# EAGLE schematic current stabiliser (EAGLE 8.3.2)

## Sheet 1 of 12
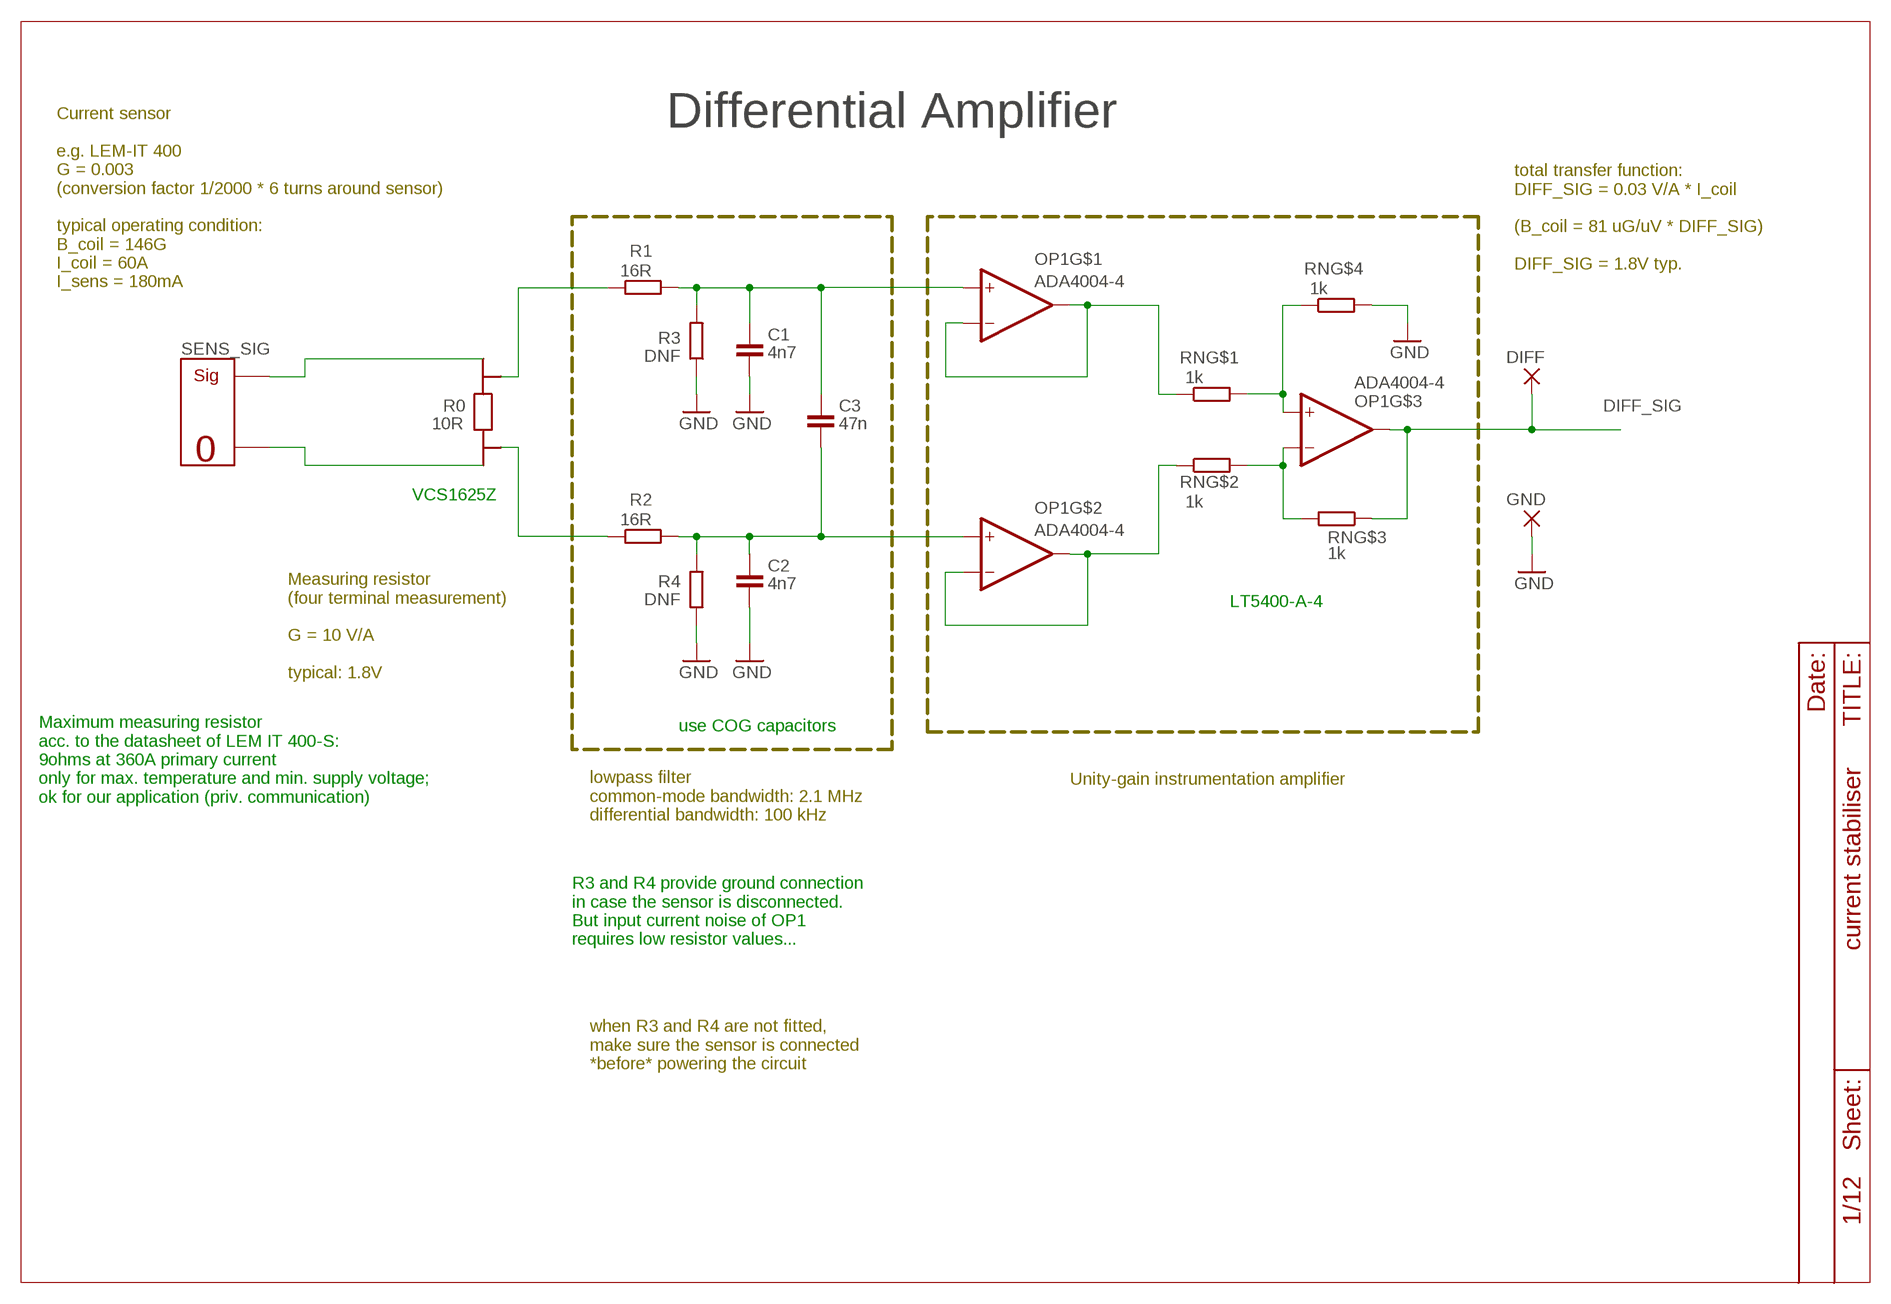
[diagram p0: schematic, sheet 1]

### Parts
C1  4n7  CAP0603  [0603]
C2  4n7  CAP0603  [0603]
C3  47n  CAP0603  [0603]
DIFF  TESTPOINT  [TESTPOINT]
GND  TESTPOINT  [TESTPOINT]
OP1  ADA4004-4  OPAMP_QUADSO14  [SO14]
R0  10R  VCS1625Z  [VCS1625Z]
R1  16R  RES0603  [0603]
R2  16R  RES0603  [0603]
R3  DNF  RES0603  [0603]
R4  DNF  RES0603  [0603]
RN  1k  LT5400-EP  [MSOP8-EP]
SENS_SIG  MOLEX_SIG_2PIN  [MOLEX-2PIN]

### Nets
DIFF_SIG: DIFF.P$1(P) OP1.P$8(OUT) RN.3 ; also sheet 2
GND: C1.2 C2.2 GND.P$1(P) R3.1 R4.1 RN.5 ; also sheet 2,3,4,5,6,7,8,9,10,11,12
N$1: R0.P$1(I1) SENS_SIG.2(SIG)
N$3: C2.1 C3.2 OP1.P$5(+IN) R2.2 R4.2
N$4: R0.P$4(E2) R2.1
N$5: R0.P$3(E1) R1.1
N$6: C1.1 C3.1 OP1.P$3(+IN) R1.2 R3.2
N$7: OP1.P$1(OUT) OP1.P$2(-IN) RN.1
N$8: OP1.P$6(-IN) OP1.P$7(OUT) RN.2
N$9: OP1.P$10(+IN) RN.4 RN.8
N$11: OP1.P$9(-IN) RN.6 RN.7
SENS_RETURN: R0.P$2(I2) SENS_SIG.1(GND)
Unconnected: OP1.P$12(+IN) OP1.P$13(-IN) OP1.P$14(OUT)

### Notes on the sheet
- Differential Amplifier
- total transfer function:
  DIFF_SIG = 0.03 V/A * I_coil
  
  (B_coil = 81 uG/uV * DIFF_SIG)
  
  DIFF_SIG = 1.8V typ.
- Current sensor
  
  e.g. LEM-IT 400
  G = 0.003
  (conversion factor 1/2000 * 6 turns around sensor)
  
  typical operating condition: 
  B_coil = 146G
  I_coil = 60A
  I_sens = 180mA
- VCS1625Z
- LT5400-A-4
- Measuring resistor
  (four terminal measurement)
  
  G = 10 V/A
  
  typical: 1.8V
- use COG capacitors
- Unity-gain instrumentation amplifier
- Maximum measuring resistor 
  acc. to the datasheet of LEM IT 400-S: 
  9ohms at 360A primary current
  only for max. temperature and min. supply voltage; 
  ok for our application (priv. communication)
- lowpass filter
  common-mode bandwidth: 2.1 MHz
  differential bandwidth: 100 kHz
- R3 and R4 provide ground connection
  in case the sensor is disconnected. 
  But input current noise of OP1 
  requires low resistor values...
- when R3 and R4 are not fitted,
  make sure the sensor is connected
  *before* powering the circuit

## Sheet 2 of 12
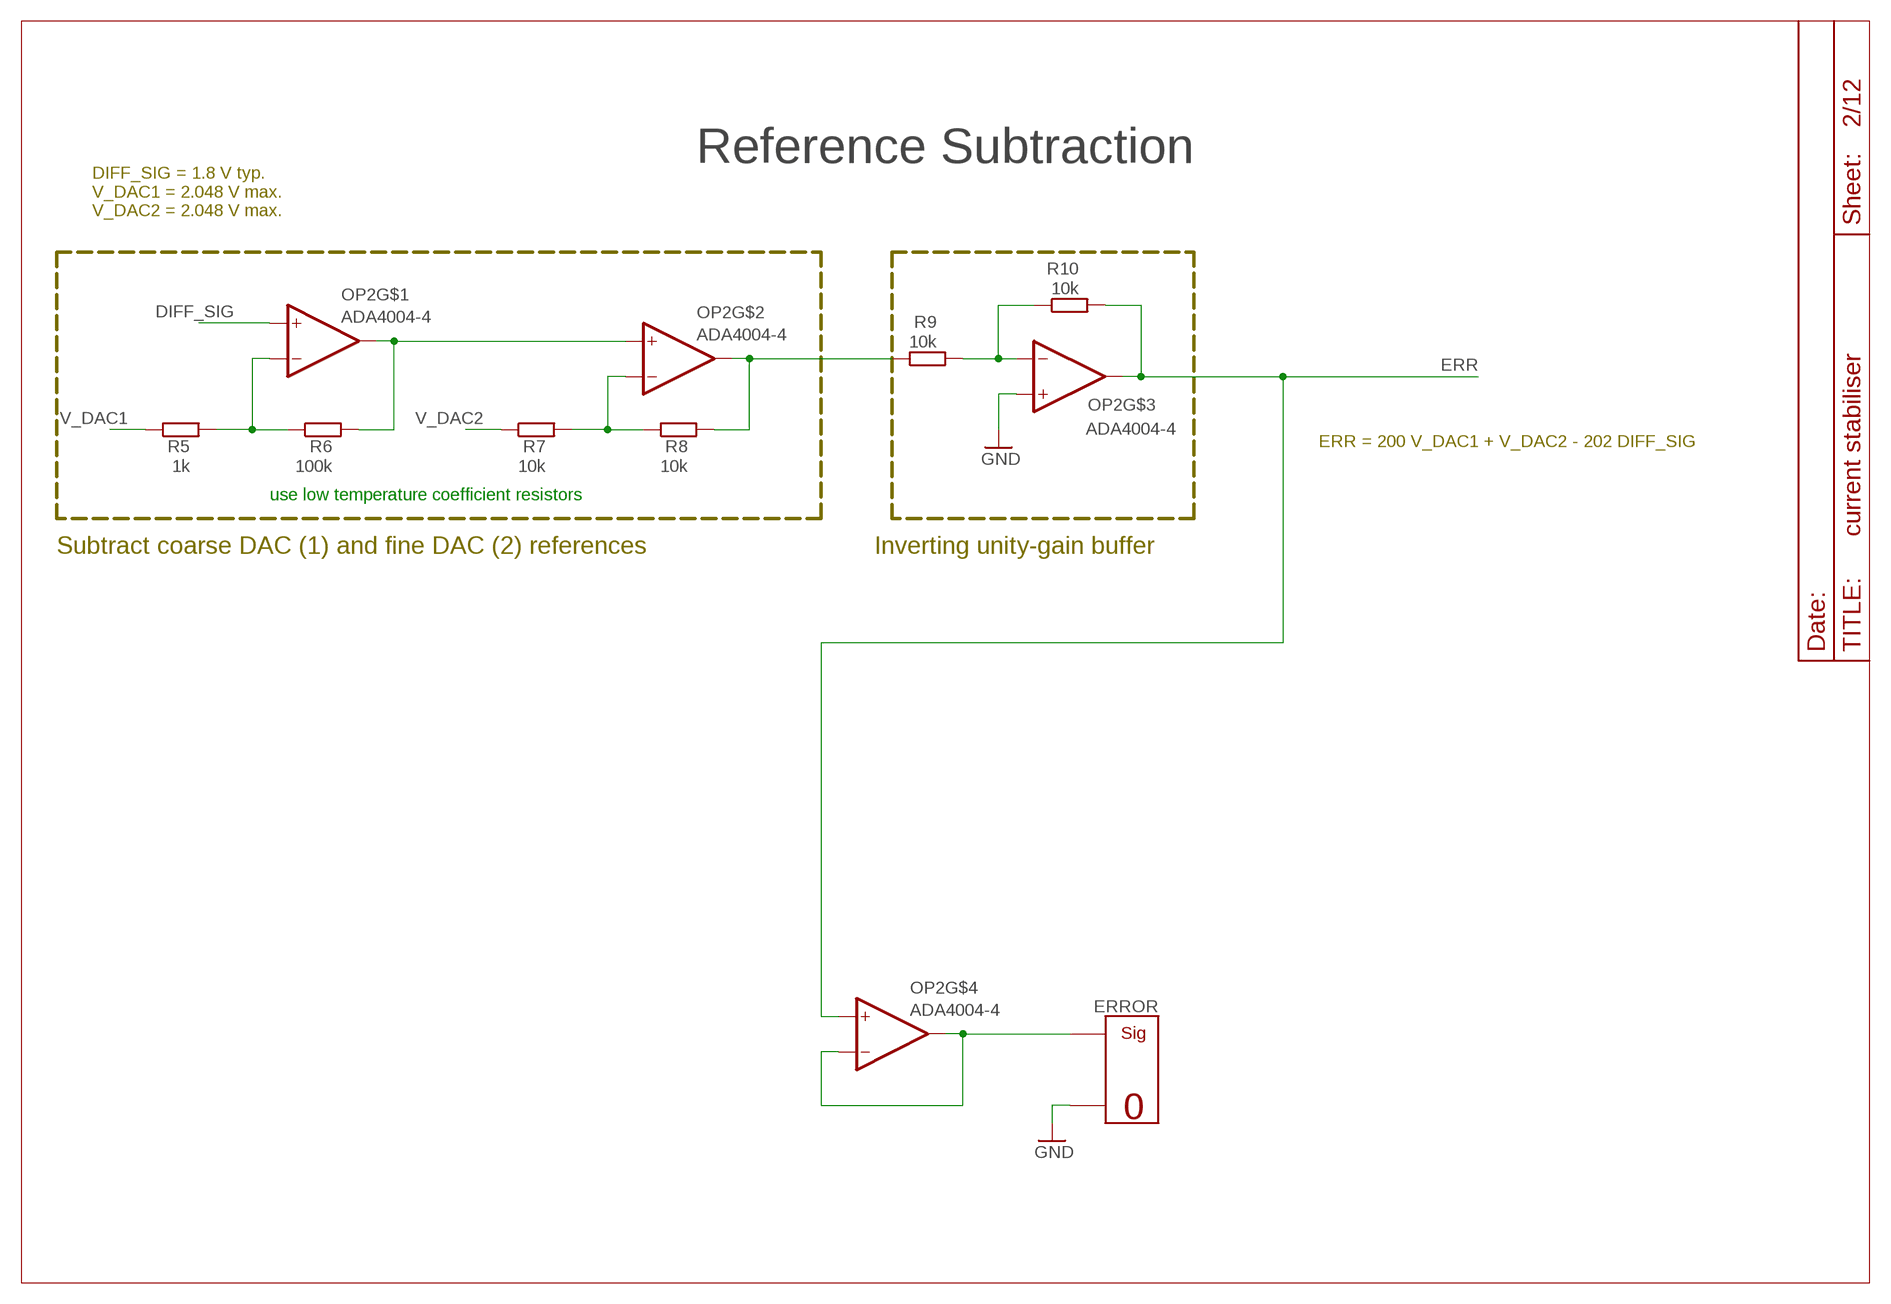
[diagram p1: schematic, sheet 2]

### Parts
ERROR  MOLEX_SIG_2PIN  [MOLEX-2PIN]
OP2  ADA4004-4  OPAMP_QUADSO14  [SO14]
R5  1k  RES0603  [0603]
R6  100k  RES0603  [0603]
R7  10k  RES0603  [0603]
R8  10k  RES0603  [0603]
R9  10k  RES0603  [0603]
R10  10k  RES0603  [0603]

### Nets
DIFF_SIG: OP2.P$3(+IN) ; also sheet 1
ERR: OP2.P$8(OUT) OP2.P$12(+IN) R10.2 ; also sheet 3
GND: ERROR.1(GND) OP2.P$10(+IN) ; also sheet 1,3,4,5,6,7,8,9,10,11,12
N$10: OP2.P$2(-IN) R5.2 R6.1
N$12: OP2.P$9(-IN) R9.2 R10.1
N$13: OP2.P$1(OUT) OP2.P$5(+IN) R6.2
N$14: OP2.P$6(-IN) R7.2 R8.1
N$15: OP2.P$7(OUT) R8.2 R9.1
N$18: ERROR.2(SIG) OP2.P$13(-IN) OP2.P$14(OUT)
V_DAC1: R5.1 ; also sheet 7
V_DAC2: R7.1 ; also sheet 7

### Notes on the sheet
- Reference Subtraction
- DIFF_SIG = 1.8 V typ.
  V_DAC1 = 2.048 V max.
  V_DAC2 = 2.048 V max.
- ERR = 200 V_DAC1 + V_DAC2 - 202 DIFF_SIG
- use low temperature coefficient resistors
- Subtract coarse DAC (1) and fine DAC (2) references | Inverting unity-gain buffer

## Sheet 3 of 12
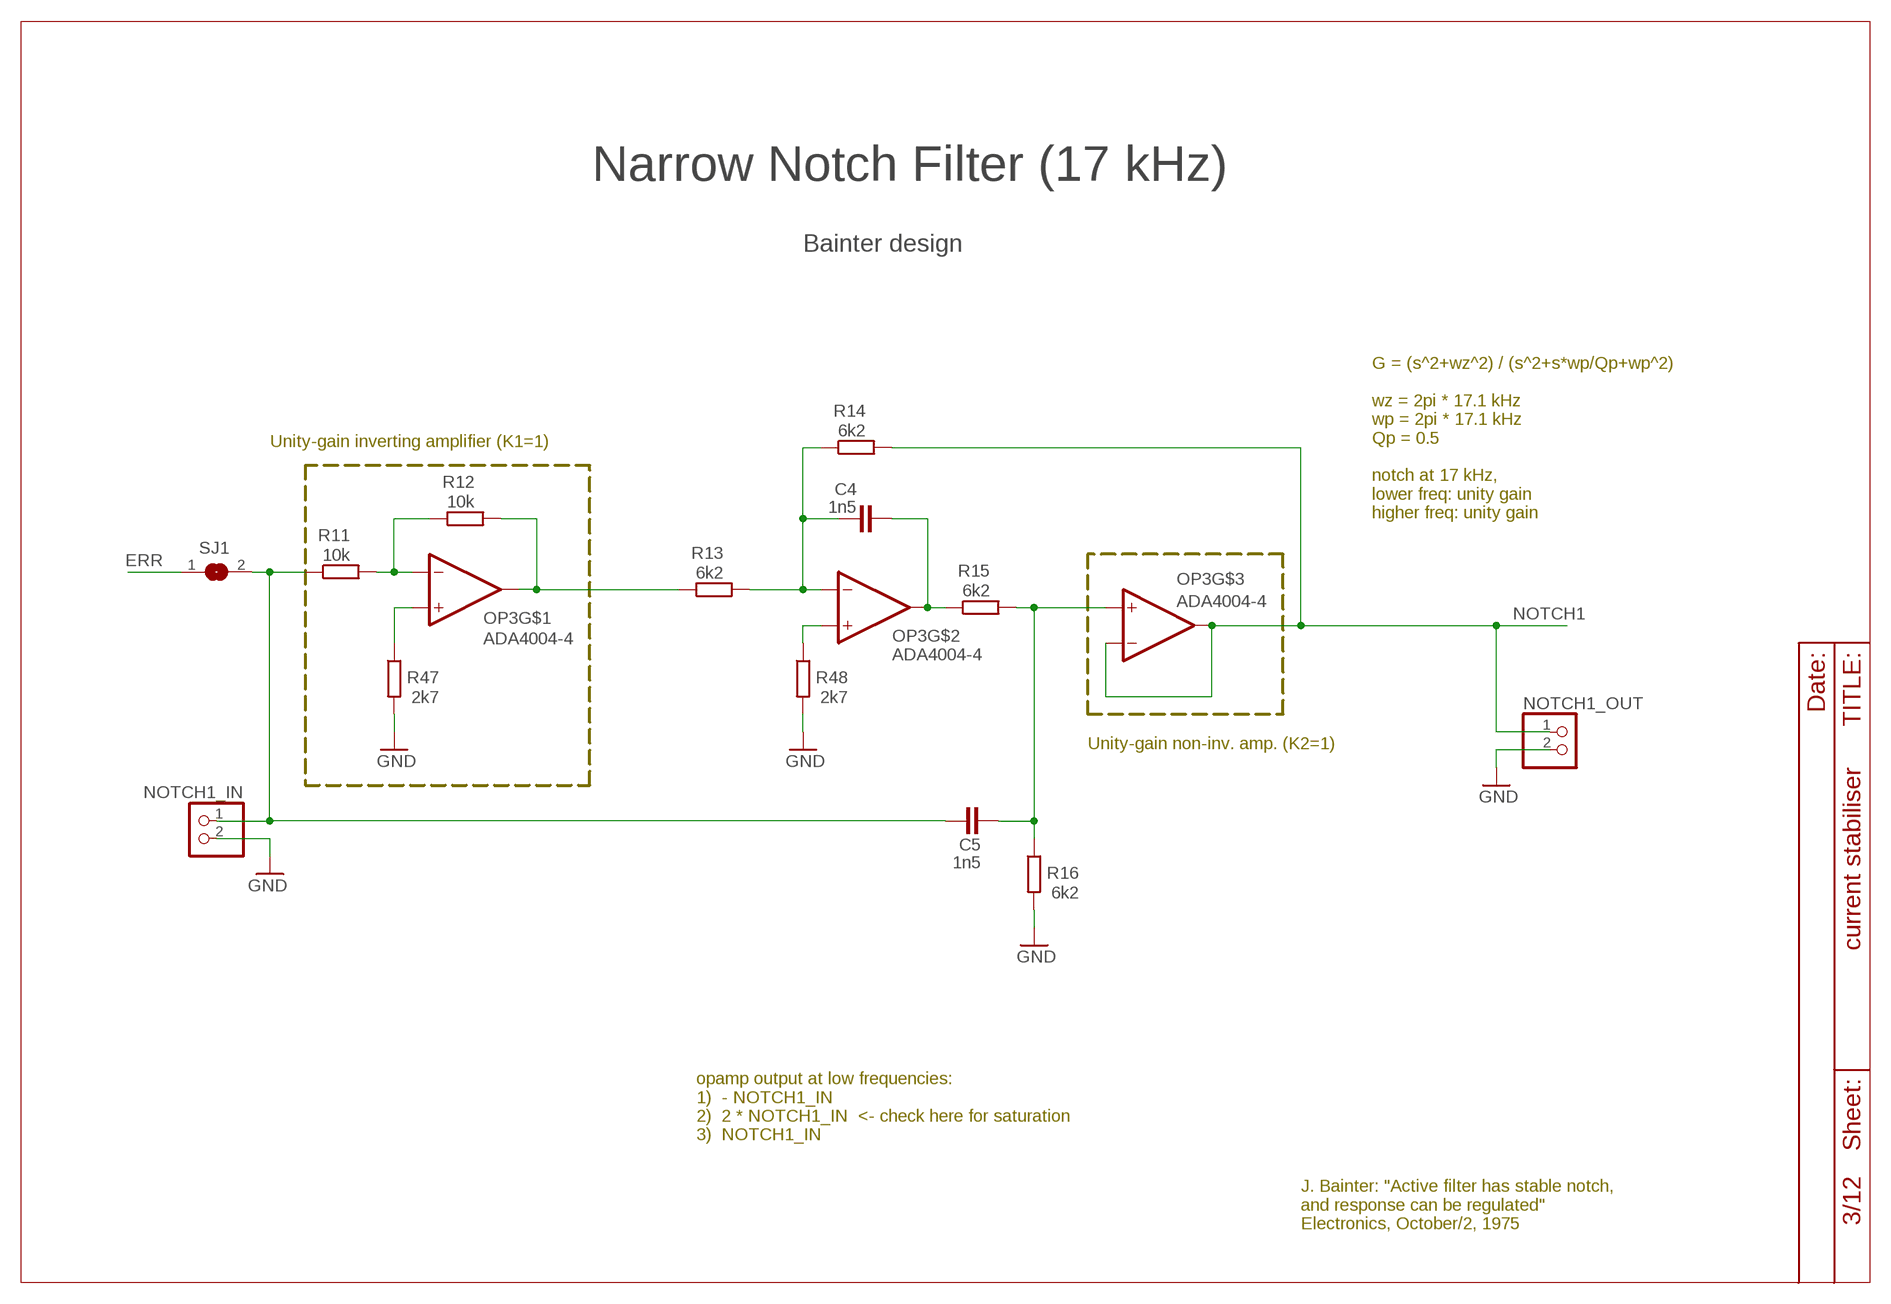
[diagram p2: schematic, sheet 3]

### Parts
C4  1n5  CAP0603  [0603]
C5  1n5  CAP0603  [0603]
NOTCH1_IN  PINHD-1X2  [1X02]
NOTCH1_OUT  PINHD-1X2  [1X02]
OP3  ADA4004-4  OPAMP_QUADSO14  [SO14]
R11  10k  RES0603  [0603]
R12  10k  RES0603  [0603]
R13  6k2  RES0603  [0603]
R14  6k2  RES0603  [0603]
R15  6k2  RES0603  [0603]
R16  6k2  RES0603  [0603]
R47  2k7  RES0603  [0603]
R48  2k7  RES0603  [0603]
SJ1  SJ  [SJ]

### Nets
ERR: SJ1.1 ; also sheet 2
GND: NOTCH1_IN.2 NOTCH1_OUT.2 R16.2 R47.2 R48.2 ; also sheet 1,2,4,5,6,7,8,9,10,11,12
N$16: OP3.P$2(-IN) R11.2 R12.1
N$17: OP3.P$1(OUT) R12.2 R13.1
N$19: C4.1 OP3.P$6(-IN) R13.2 R14.1
N$20: C4.2 OP3.P$7(OUT) R15.1
N$22: C5.2 OP3.P$10(+IN) R15.2 R16.1
N$72: C5.1 NOTCH1_IN.1 R11.1 SJ1.2
N$79: OP3.P$3(+IN) R47.1
N$80: OP3.P$5(+IN) R48.1
NOTCH1: NOTCH1_OUT.1 OP3.P$8(OUT) OP3.P$9(-IN) R14.2 ; also sheet 4
Unconnected: OP3.P$12(+IN) OP3.P$13(-IN) OP3.P$14(OUT)

### Notes on the sheet
- Narrow Notch Filter (17 kHz)
- Bainter design
- Unity-gain inverting amplifier (K1=1)
- G = (s^2+wz^2) / (s^2+s*wp/Qp+wp^2)
  
  wz = 2pi * 17.1 kHz
  wp = 2pi * 17.1 kHz
  Qp = 0.5
  
  notch at 17 kHz,
  lower freq: unity gain
  higher freq: unity gain
- Unity-gain non-inv. amp. (K2=1)
- opamp output at low frequencies:
  1)  - NOTCH1_IN
  2)  2 * NOTCH1_IN  <- check here for saturation
  3)  NOTCH1_IN
- J. Bainter: "Active filter has stable notch, 
  and response can be regulated"
  Electronics, October/2, 1975

## Sheet 4 of 12
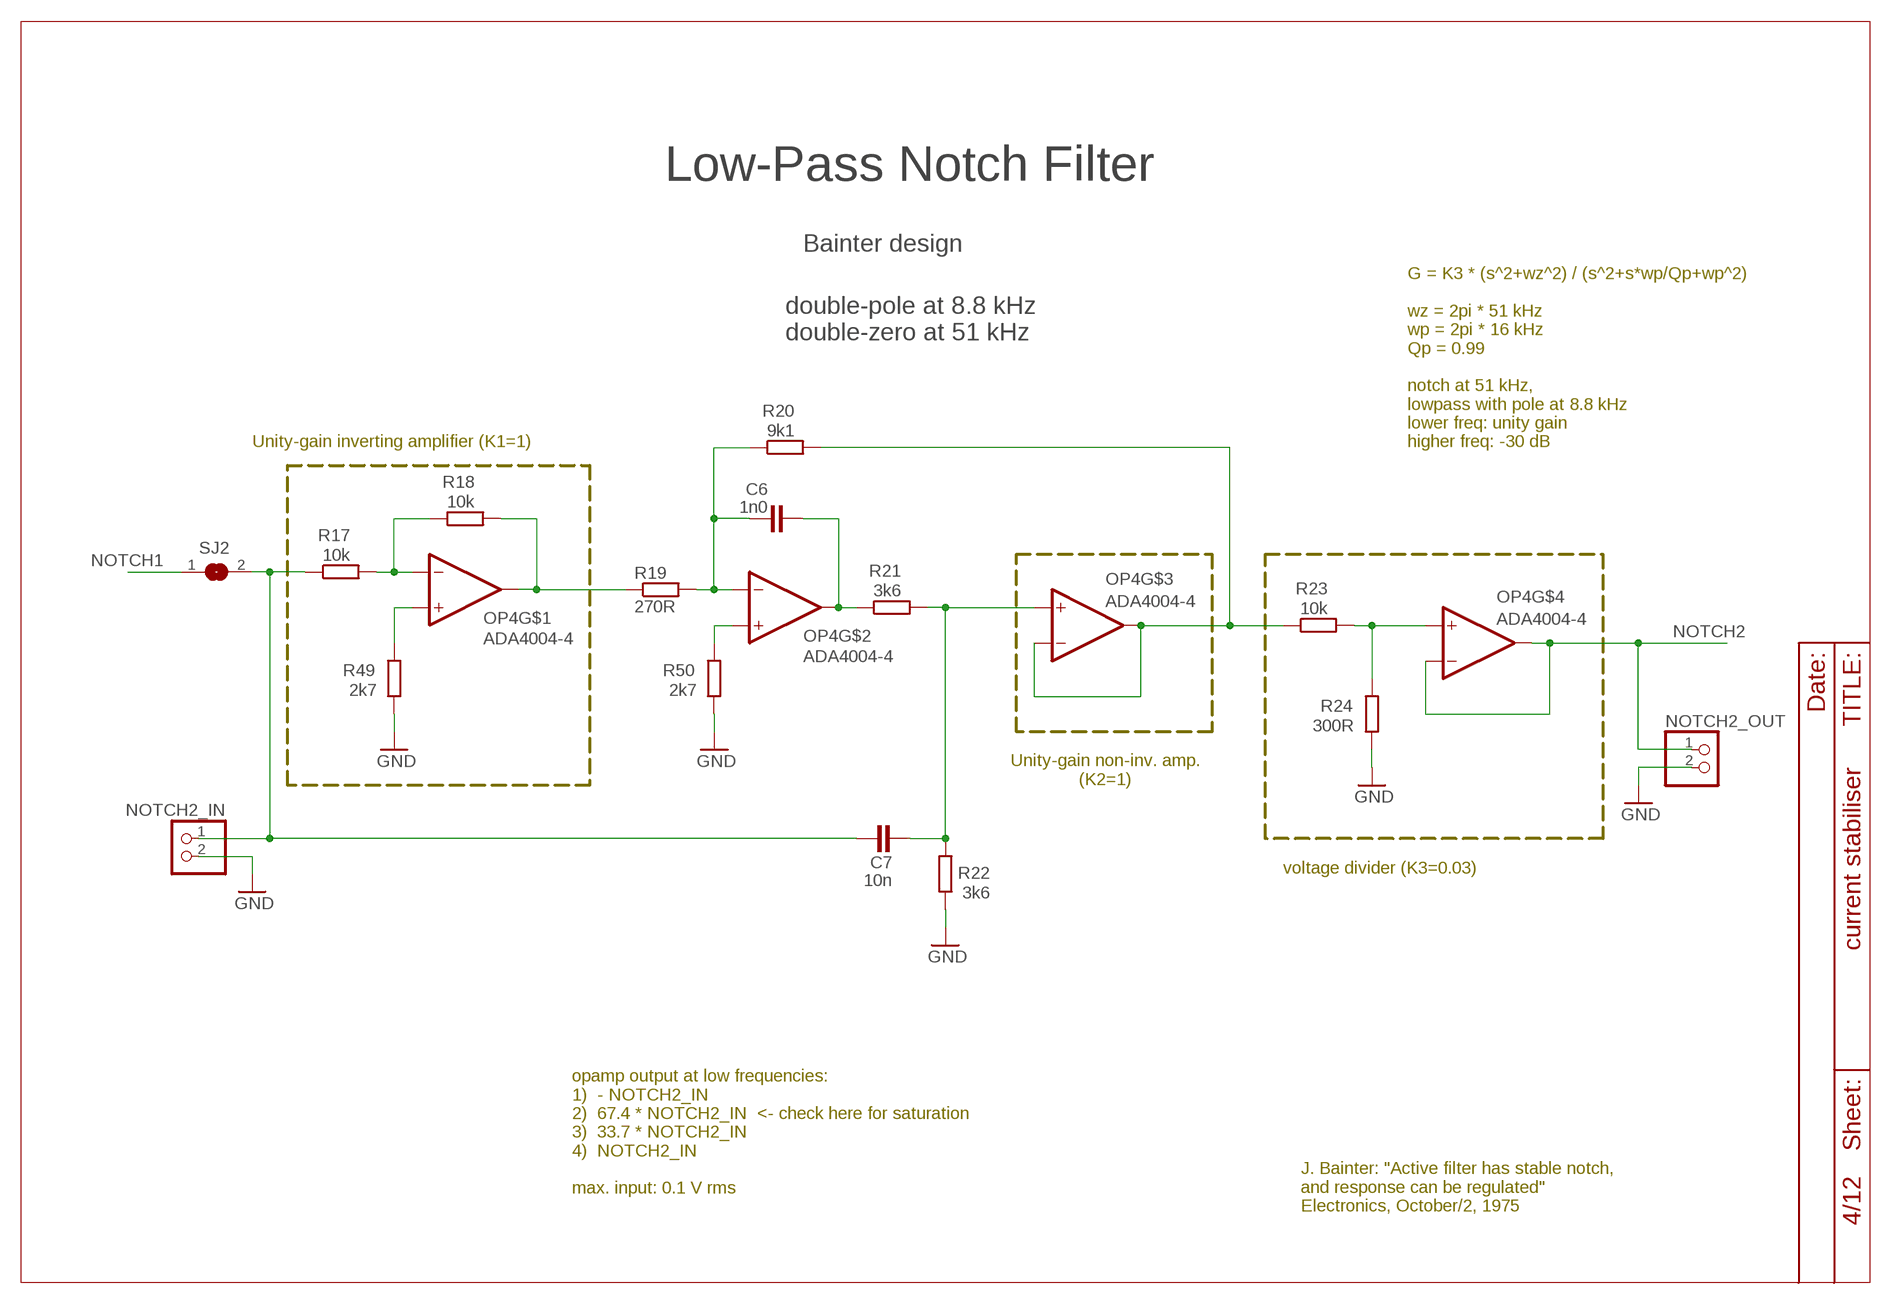
[diagram p3: schematic, sheet 4]

### Parts
C6  1n0  CAP0603  [0603]
C7  10n  CAP0603  [0603]
NOTCH2_IN  PINHD-1X2  [1X02]
NOTCH2_OUT  PINHD-1X2  [1X02]
OP4  ADA4004-4  OPAMP_QUADSO14  [SO14]
R17  10k  RES0603  [0603]
R18  10k  RES0603  [0603]
R19  270R  RES0603  [0603]
R20  9k1  RES0603  [0603]
R21  3k6  RES0603  [0603]
R22  3k6  RES0603  [0603]
R23  10k  RES0603  [0603]
R24  300R  RES0603  [0603]
R49  2k7  RES0603  [0603]
R50  2k7  RES0603  [0603]
SJ2  SJ  [SJ]

### Nets
GND: NOTCH2_IN.2 NOTCH2_OUT.2 R22.1 R24.1 R49.1 R50.1 ; also sheet 1,2,3,5,6,7,8,9,10,11,12
N$21: OP4.P$2(-IN) R17.2 R18.1
N$23: OP4.P$1(OUT) R18.2 R19.1
N$24: C6.1 OP4.P$6(-IN) R19.2 R20.1
N$25: C7.2 OP4.P$10(+IN) R21.2 R22.2
N$26: C6.2 OP4.P$7(OUT) R21.1
N$27: OP4.P$8(OUT) OP4.P$9(-IN) R20.2 R23.1
N$28: OP4.P$12(+IN) R23.2 R24.2
N$74: C7.1 NOTCH2_IN.1 R17.1 SJ2.2
N$76: OP4.P$3(+IN) R49.2
N$77: OP4.P$5(+IN) R50.2
NOTCH1: SJ2.1 ; also sheet 3
NOTCH2: NOTCH2_OUT.1 OP4.P$13(-IN) OP4.P$14(OUT) ; also sheet 5

### Notes on the sheet
- Low-Pass Notch Filter
- Bainter design
- double-pole at 8.8 kHz
  double-zero at 51 kHz
- Unity-gain inverting amplifier (K1=1)
- G = K3 * (s^2+wz^2) / (s^2+s*wp/Qp+wp^2)
  
  wz = 2pi * 51 kHz
  wp = 2pi * 16 kHz
  Qp = 0.99
  
  notch at 51 kHz,
  lowpass with pole at 8.8 kHz
  lower freq: unity gain
  higher freq: -30 dB
- Unity-gain non-inv. amp.
  (K2=1)
- voltage divider (K3=0.03)
- opamp output at low frequencies:
  1)  - NOTCH2_IN
  2)  67.4 * NOTCH2_IN  <- check here for saturation
  3)  33.7 * NOTCH2_IN
  4)  NOTCH2_IN
  
  max. input: 0.1 V rms
- J. Bainter: "Active filter has stable notch, 
  and response can be regulated"
  Electronics, October/2, 1975

## Sheet 5 of 12
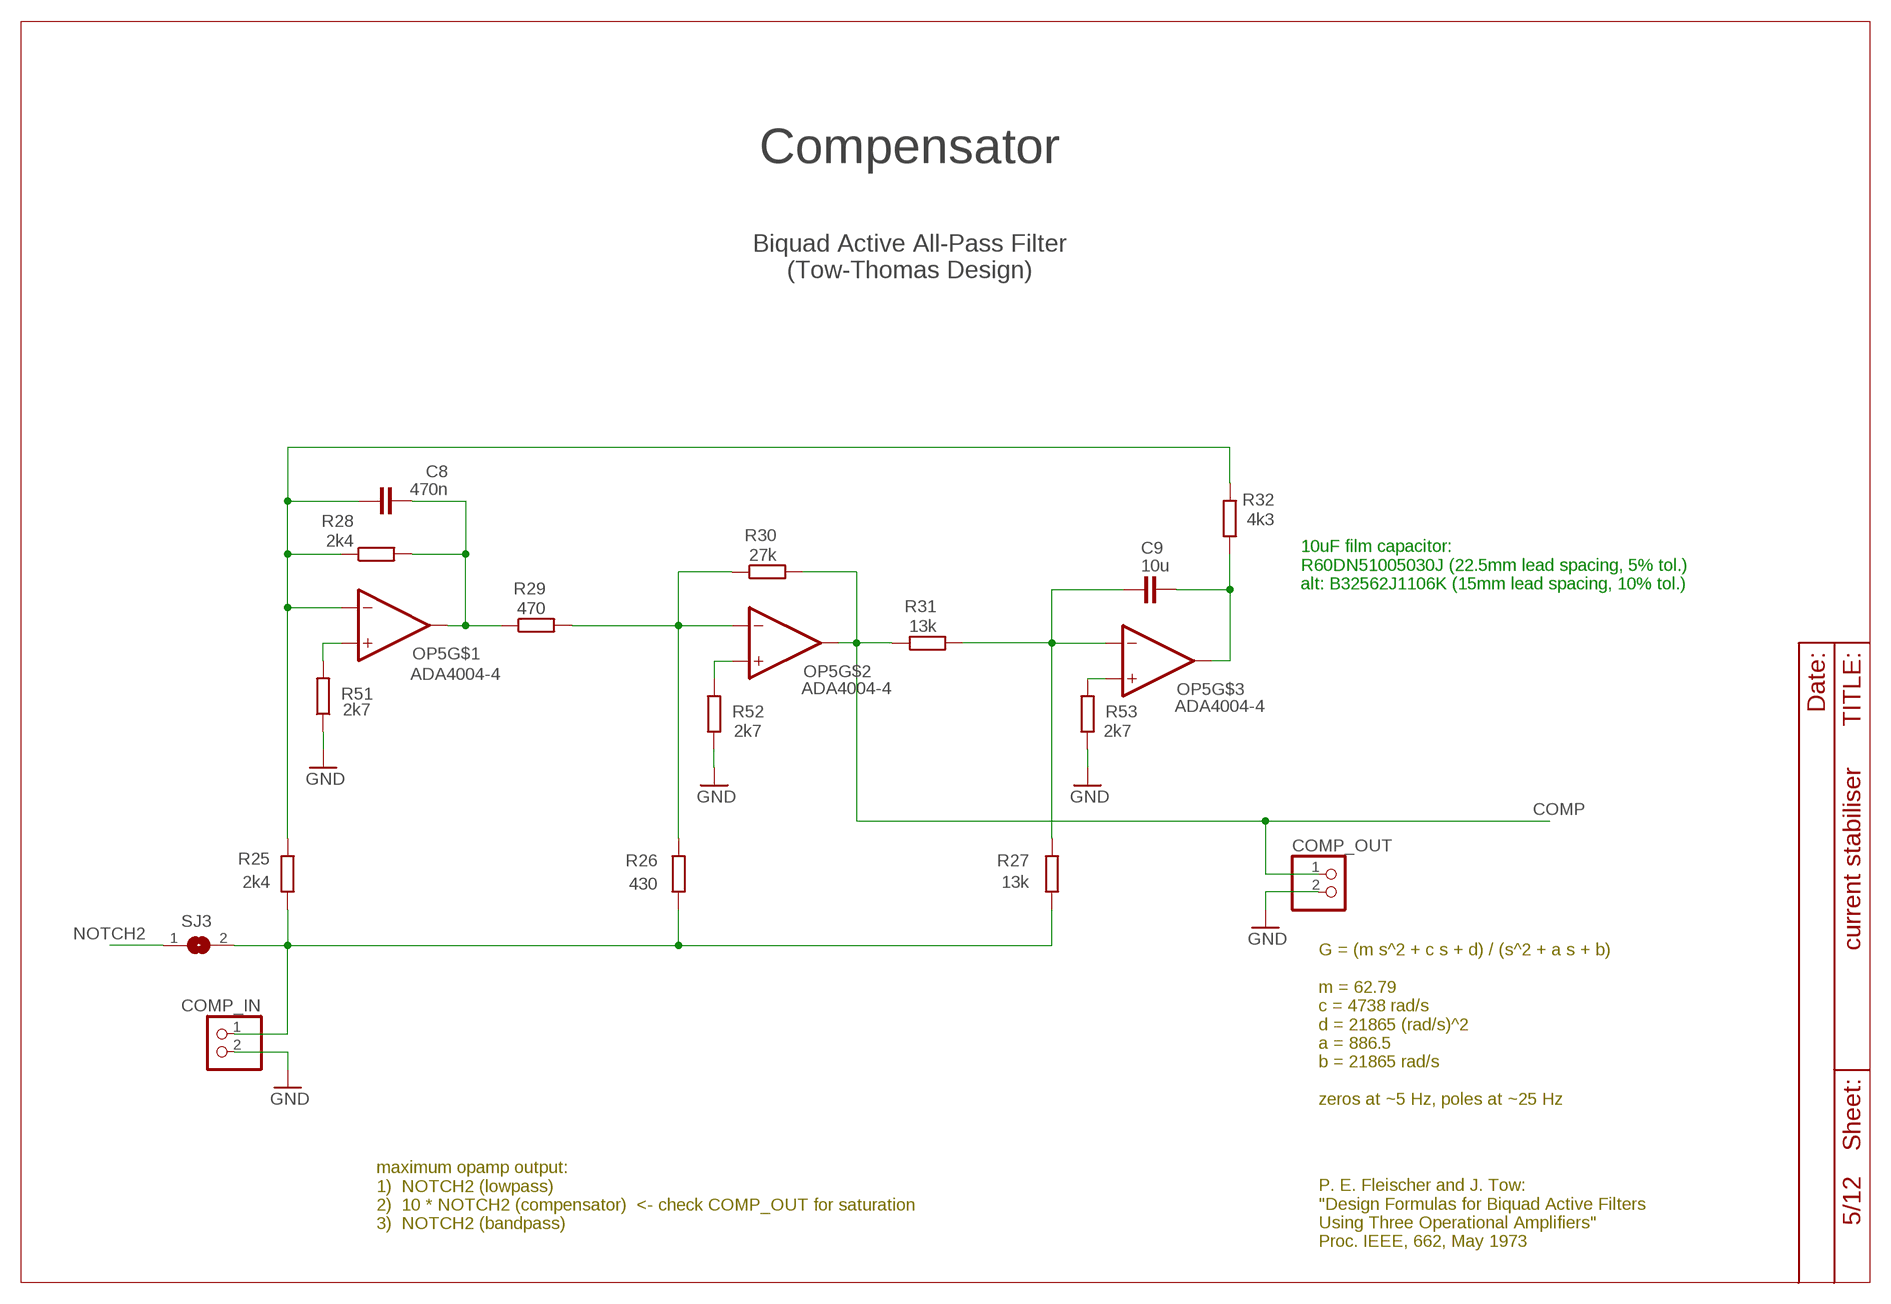
[diagram p4: schematic, sheet 5]

### Parts
C8  470n  CAP0603  [0603]
C9  10u  CAP26.5X8.5  [CAP-26.5X8.5]
COMP_IN  PINHD-1X2  [1X02]
COMP_OUT  PINHD-1X2  [1X02]
OP5  ADA4004-4  OPAMP_QUADSO14  [SO14]
R25  2k4  RES0603  [0603]
R26  430  RES0603  [0603]
R27  13k  RES0603  [0603]
R28  2k4  RES0603  [0603]
R29  470  RES0603  [0603]
R30  27k  RES0603  [0603]
R31  13k  RES0603  [0603]
R32  4k3  RES0603  [0603]
R51  2k7  RES0603  [0603]
R52  2k7  RES0603  [0603]
R53  2k7  RES0603  [0603]
SJ3  SJ  [SJ]

### Nets
COMP: COMP_OUT.1 OP5.P$7(OUT) R30.2 R31.1 ; also sheet 6
GND: COMP_IN.2 COMP_OUT.2 R51.1 R52.1 R53.1 ; also sheet 1,2,3,4,6,7,8,9,10,11,12
N$29: C8.1 OP5.P$2(-IN) R25.2 R28.1 R32.2
N$30: OP5.P$6(-IN) R26.2 R29.2 R30.1
N$31: C9.P$1 OP5.P$9(-IN) R27.2 R31.2
N$32: C8.2 OP5.P$1(OUT) R28.2 R29.1
N$35: C9.P$2 OP5.P$8(OUT) R32.1
N$75: COMP_IN.1 R25.1 R26.1 R27.1 SJ3.2
N$81: OP5.P$3(+IN) R51.2
N$82: OP5.P$5(+IN) R52.2
N$83: OP5.P$10(+IN) R53.2
NOTCH2: SJ3.1 ; also sheet 4
Unconnected: OP5.P$12(+IN) OP5.P$13(-IN) OP5.P$14(OUT)

### Notes on the sheet
- Compensator
- Biquad Active All-Pass Filter
  (Tow-Thomas Design)
- 10uF film capacitor:
  R60DN51005030J (22.5mm lead spacing, 5% tol.)
  alt: B32562J1106K (15mm lead spacing, 10% tol.)
- G = (m s^2 + c s + d) / (s^2 + a s + b)
  
  m = 62.79
  c = 4738 rad/s
  d = 21865 (rad/s)^2
  a = 886.5
  b = 21865 rad/s
  
  zeros at ~5 Hz, poles at ~25 Hz
- maximum opamp output:
  1)  NOTCH2 (lowpass)
  2)  10 * NOTCH2 (compensator)  <- check COMP_OUT for saturation
  3)  NOTCH2 (bandpass)
- P. E. Fleischer and J. Tow: 
  "Design Formulas for Biquad Active Filters 
  Using Three Operational Amplifiers"
  Proc. IEEE, 662, May 1973

## Sheet 6 of 12
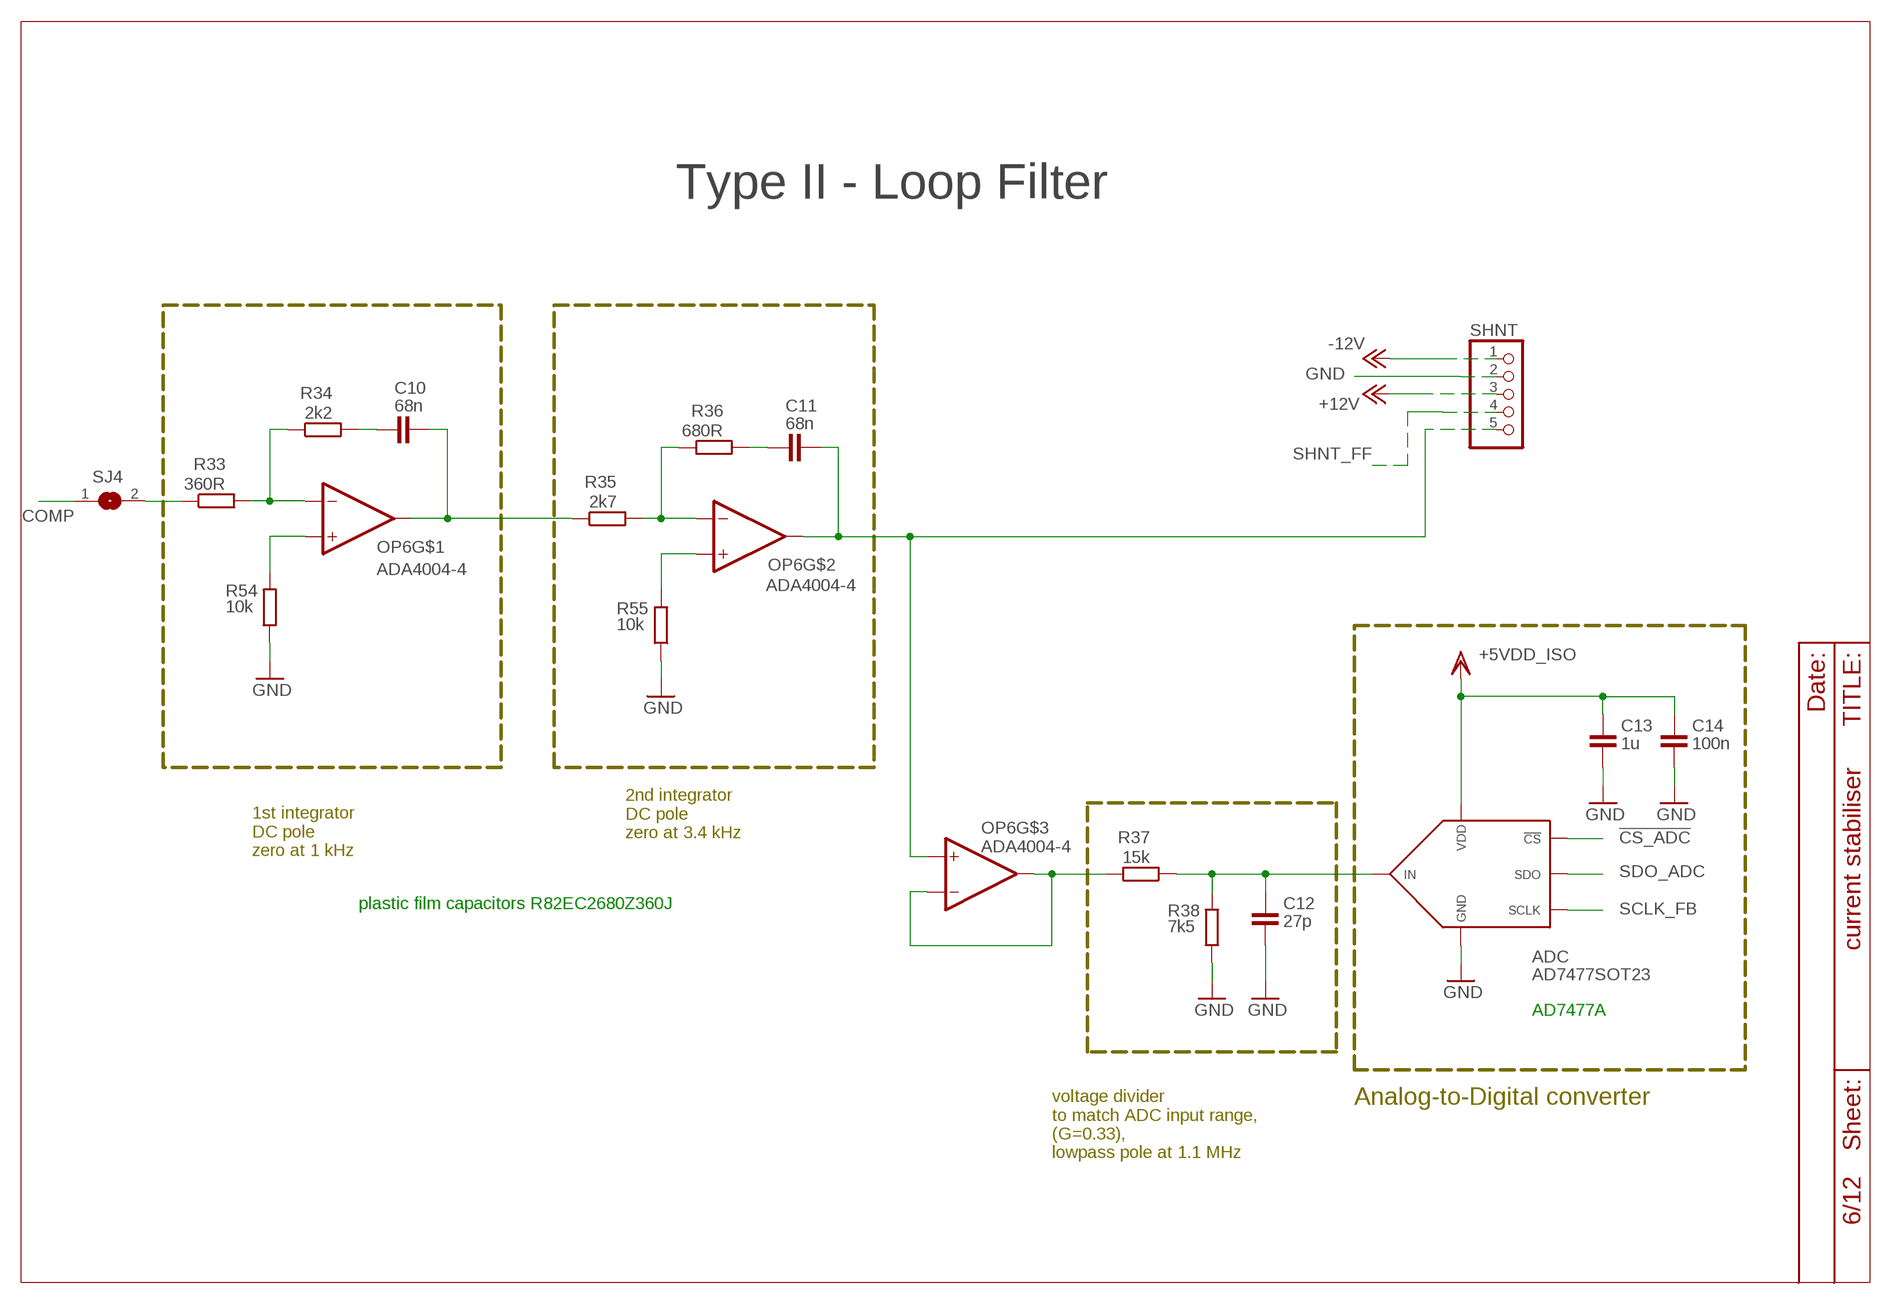
[diagram p5: schematic, sheet 6]

### Parts
ADC  AD7477SOT23  [SOT23-6]
C10  68n  CAPR82EC-7.2X2.5  [CAP-R82EC-7.2X2.5]
C11  68n  CAPR82EC-7.2X2.5  [CAP-R82EC-7.2X2.5]
C12  27p  CAP0603  [0603]
C13  1u  CAP0805  [0805]
C14  100n  CAP0603  [0603]
OP6  ADA4004-4  OPAMP_QUADSO14  [SO14]
R33  360R  RES0603  [0603]
R34  2k2  RES0603  [0603]
R35  2k7  RES0603  [0603]
R36  680R  RES0603  [0603]
R37  15k  RES0603  [0603]
R38  7k5  RES0603  [0603]
R54  10k  RES0603  [0603]
R55  10k  RES0603  [0603]
SHNT  MOLEX-KK-1X5  [MOLEX-KK-5PIN]
SJ4  SJ  [SJ]

### Nets
!CS_ADC: ADC.6(!CS) ; also sheet 10
+5VDD_ISO: ADC.1(VDD) C13.1 C14.1 ; also sheet 8,10,11
+12V: SHNT.3 ; also sheet 11,12
-12V: SHNT.1 ; also sheet 11,12
COMP: SJ4.1 ; also sheet 5
GND: ADC.2(GND) C12.2 C13.2 C14.2 R38.1 R54.1 R55.1 SHNT.2 ; also sheet 1,2,3,4,5,7,8,9,10,11,12
N$33: OP6.P$2(-IN) R33.2 R34.1
N$34: OP6.P$3(+IN) R54.2
N$36: OP6.P$5(+IN) R55.2
N$37: OP6.P$6(-IN) R35.2 R36.1
N$38: C11.P$1 R36.2
N$39: C10.P$1 R34.2
N$40: C10.P$2 OP6.P$1(OUT) R35.1
N$43: OP6.P$8(OUT) OP6.P$9(-IN) R37.2
N$73: ADC.3(IN) C12.1 R37.1 R38.2
N$85: R33.1 SJ4.2
SCLK_FB: ADC.4(SCLK) ; also sheet 7,10
SDO_ADC: ADC.5(SDO) ; also sheet 10
SHNT_FB: C11.P$2 OP6.P$7(OUT) OP6.P$10(+IN) SHNT.5
SHNT_FF: SHNT.4 ; also sheet 8
Unconnected: OP6.P$12(+IN) OP6.P$13(-IN) OP6.P$14(OUT)

### Notes on the sheet
- Type II - Loop Filter
- 2nd integrator
  DC pole
  zero at 3.4 kHz
- 1st integrator
  DC pole
  zero at 1 kHz
- plastic film capacitors R82EC2680Z360J
- AD7477A
- Analog-to-Digital converter
- voltage divider 
  to match ADC input range,
  (G=0.33),
  lowpass pole at 1.1 MHz

## Sheet 7 of 12
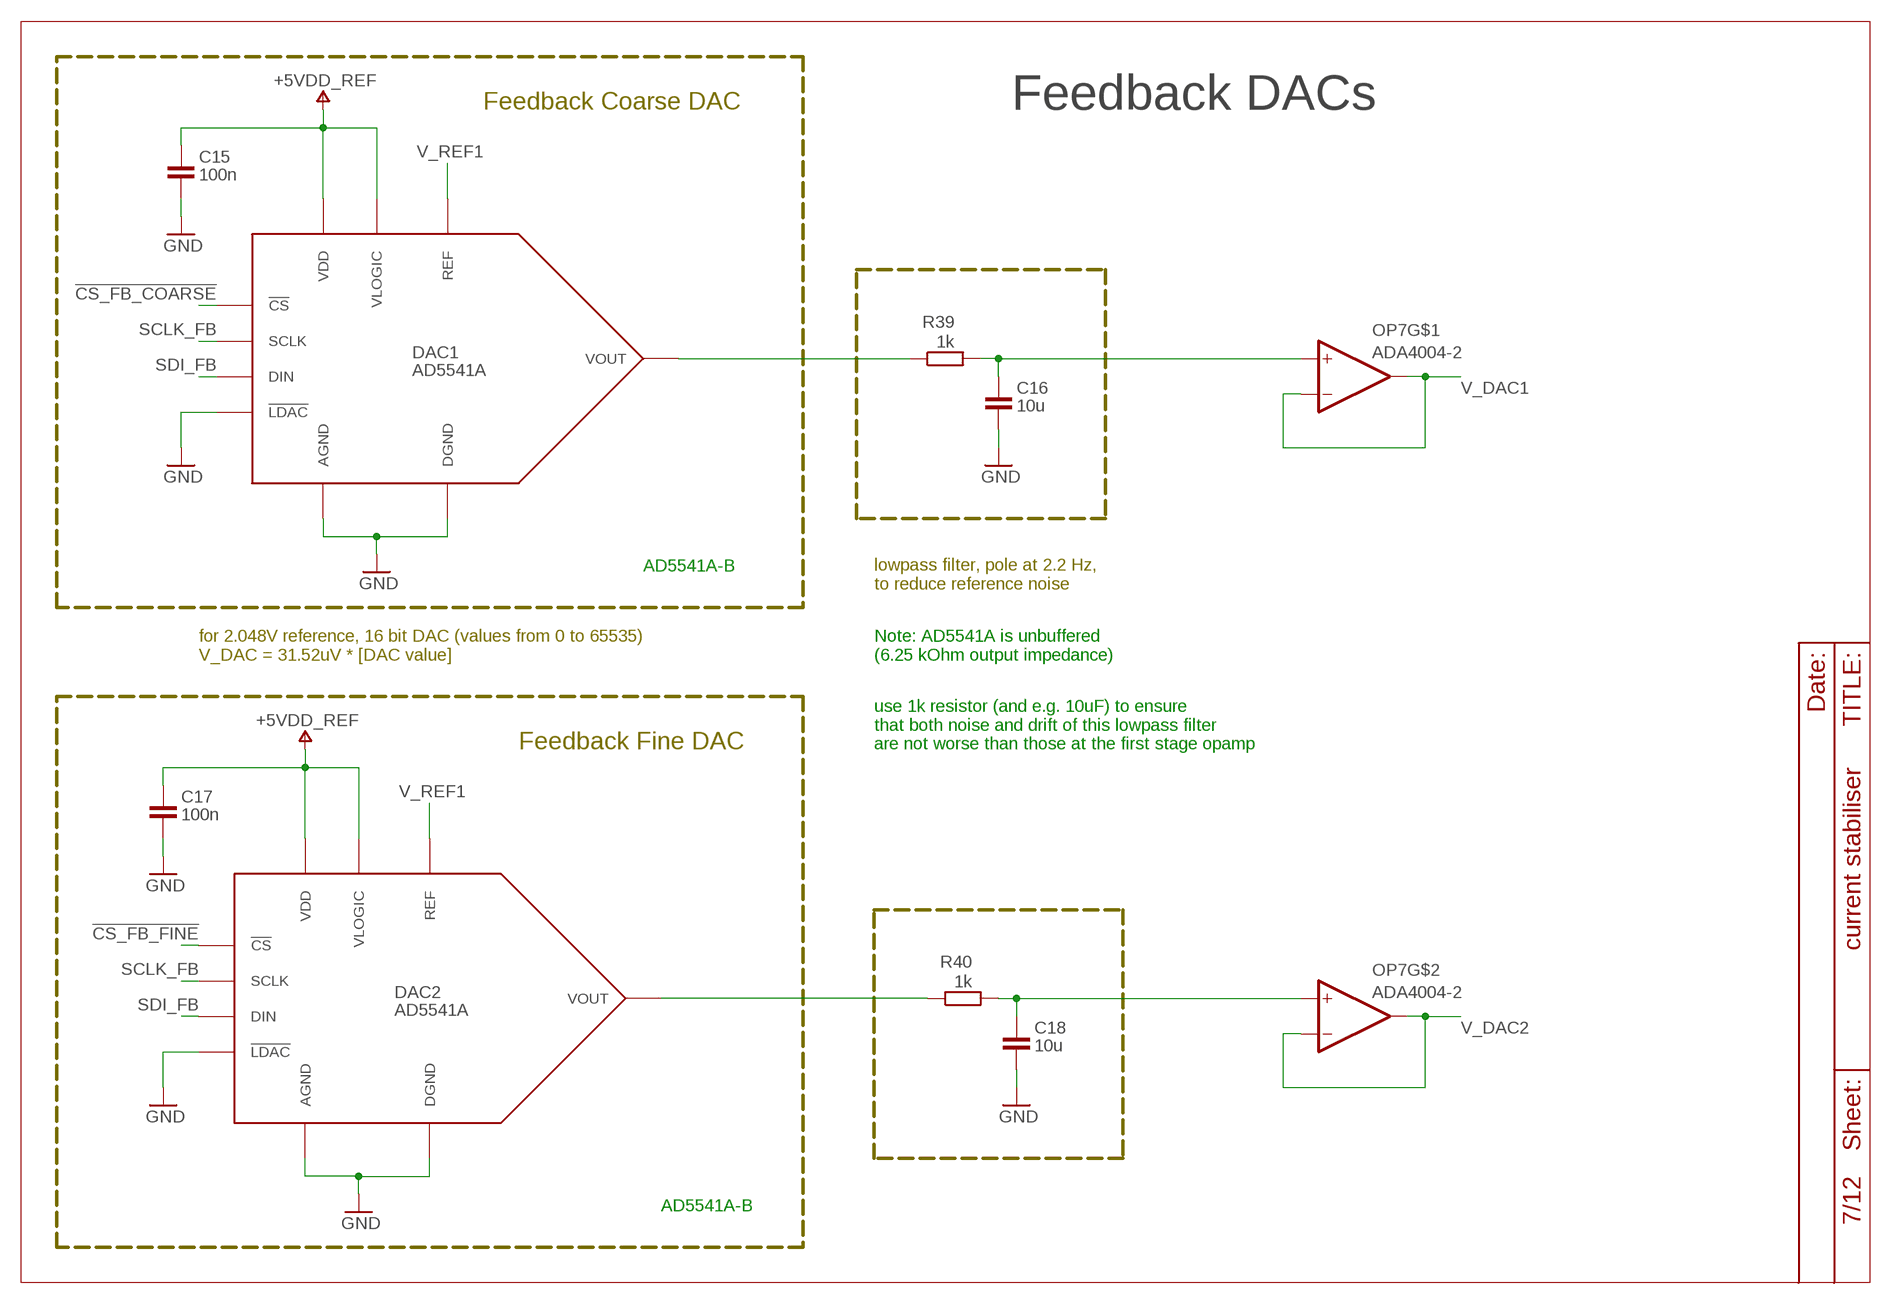
[diagram p6: schematic, sheet 7]

### Parts
C15  100n  CAP0603  [0603]
C16  10u  CAP0805  [0805]
C17  100n  CAP0603  [0603]
C18  10u  CAP0805  [0805]
DAC1  AD5541A  [MSOP10_LONG]
DAC2  AD5541A  [MSOP10_LONG]
OP7  ADA4004-2  OPAMP_DUAL  [SO8]
R39  1k  RES0603  [0603]
R40  1k  RES0603  [0603]

### Nets
!CS_FB_COARSE: DAC1.5(!CS) ; also sheet 10
!CS_FB_FINE: DAC2.5(!CS) ; also sheet 10
+5VDD_REF: C15.1 C17.1 DAC1.1(VDD) DAC1.10(VLOGIC) DAC2.1(VDD) DAC2.10(VLOGIC) ; also sheet 9,11
GND: C15.2 C16.2 C17.2 C18.2 DAC1.3(AGND) DAC1.8(!LDAC) DAC1.9(DGND) DAC2.3(AGND) DAC2.8(!LDAC) DAC2.9(DGND) ; also sheet 1,2,3,4,5,6,8,9,10,11,12
N$48: DAC1.2(VOUT) R39.1
N$50: C16.1 OP7.3(+IN) R39.2
N$69: DAC2.2(VOUT) R40.1
N$70: C18.1 OP7.5(+IN) R40.2
SCLK_FB: DAC1.6(SCLK) DAC2.6(SCLK) ; also sheet 6,10
SDI_FB: DAC1.7(DIN) DAC2.7(DIN) ; also sheet 10
V_DAC1: OP7.1(OUT) OP7.2(-IN) ; also sheet 2
V_DAC2: OP7.6(-IN) OP7.7(OUT) ; also sheet 2
V_REF1: DAC1.4(REF) DAC2.4(REF) ; also sheet 9

### Notes on the sheet
- Feedback Coarse DAC | Feedback DACs
- AD5541A-B
- lowpass filter, pole at 2.2 Hz,
  to reduce reference noise
- for 2.048V reference, 16 bit DAC (values from 0 to 65535)
  V_DAC = 31.52uV * [DAC value]
- Note: AD5541A is unbuffered
  (6.25 kOhm output impedance)
- Feedback Fine DAC
- use 1k resistor (and e.g. 10uF) to ensure 
  that both noise and drift of this lowpass filter 
  are not worse than those at the first stage opamp
- AD5541A-B

## Sheet 8 of 12
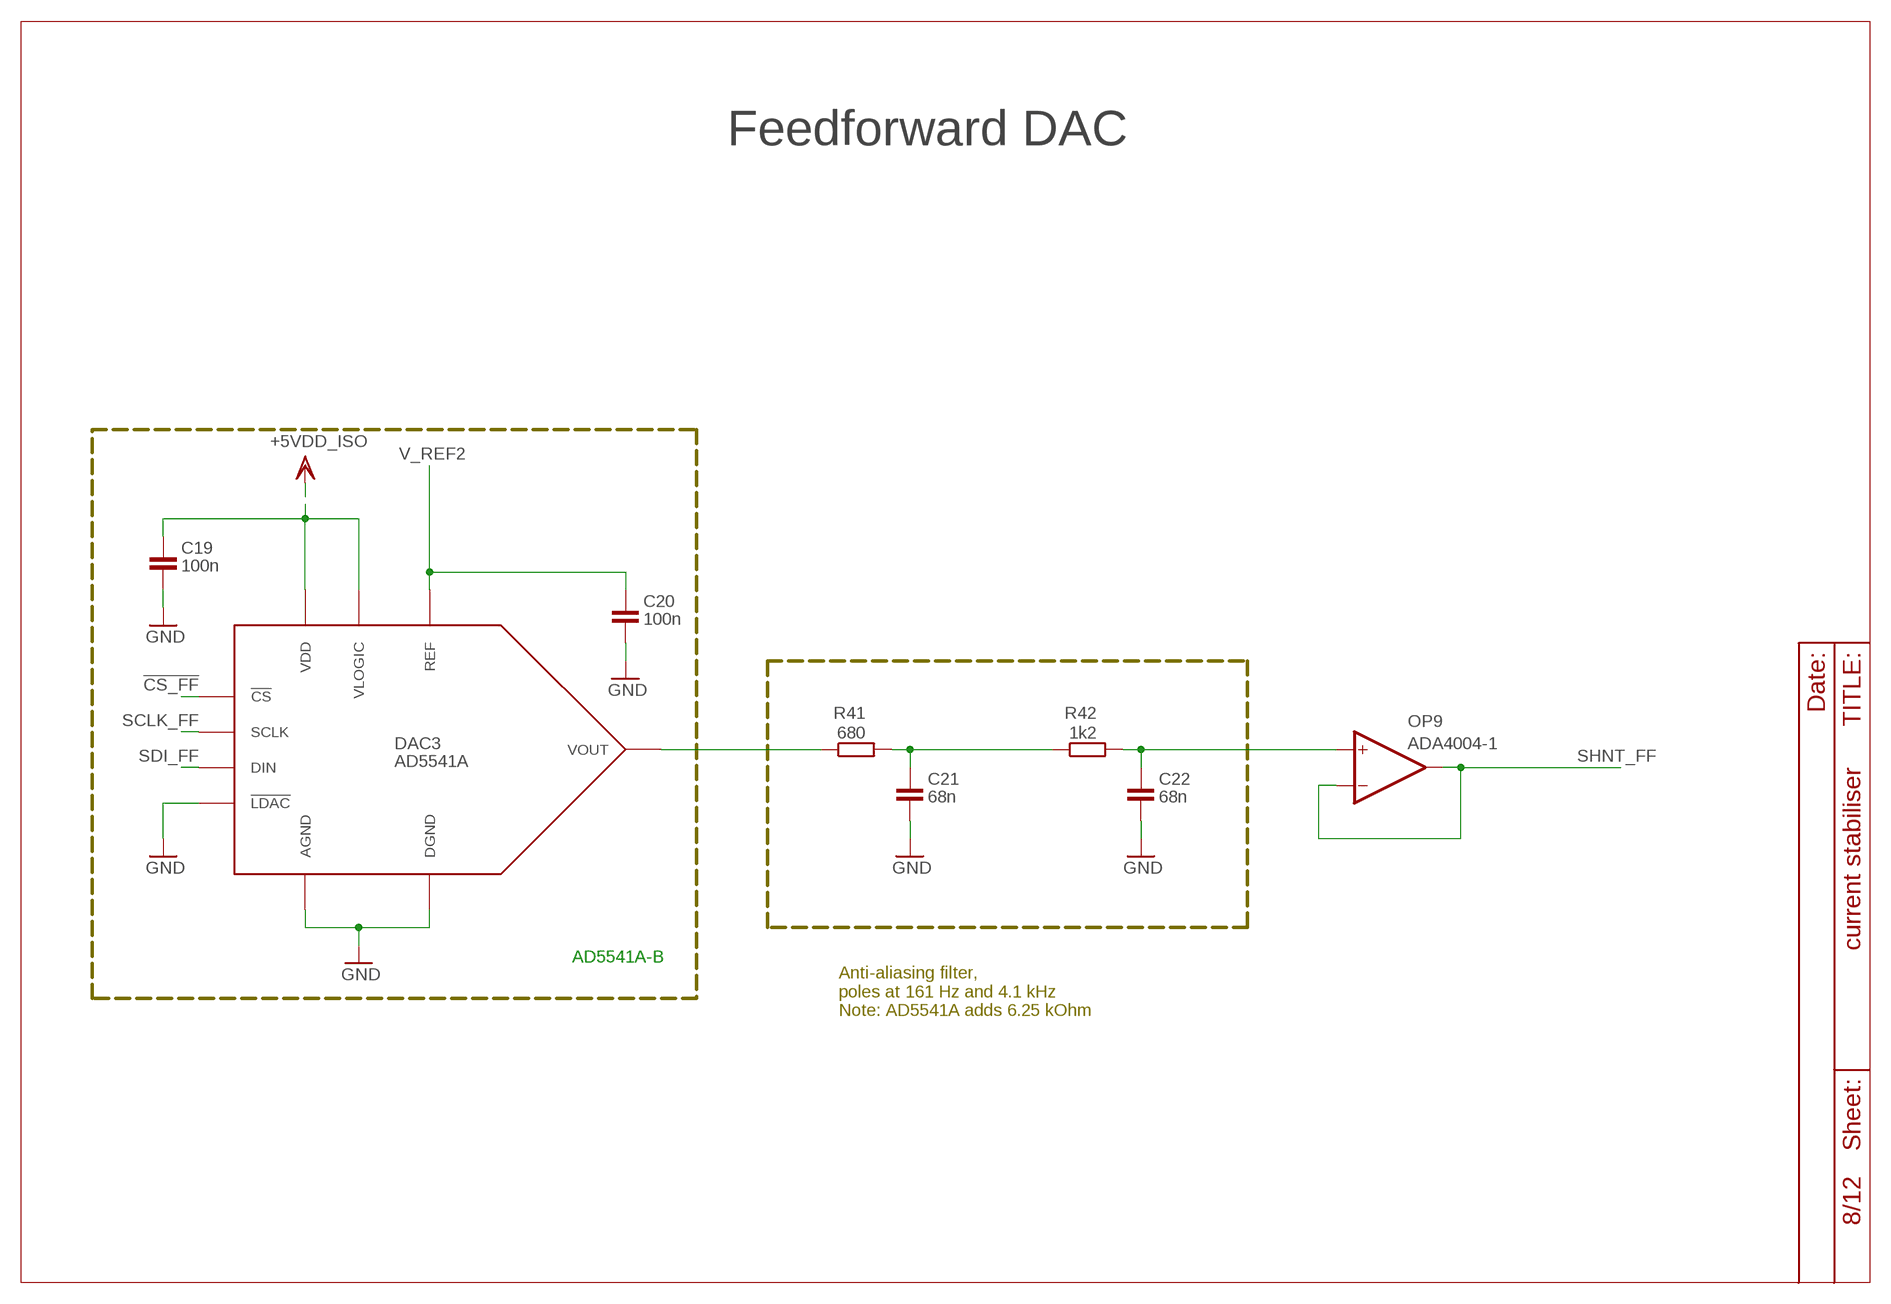
[diagram p7: schematic, sheet 8]

### Parts
C19  100n  CAP0603  [0603]
C20  100n  CAP0603  [0603]
C21  68n  CAP0603  [0603]
C22  68n  CAP0603  [0603]
DAC3  AD5541A  [MSOP10_LONG]
OP9  ADA4004-1  OPAMPSOT23-5  [SOT23-5]
R41  680  RES0603  [0603]
R42  1k2  RES0603  [0603]

### Nets
!CS_FF: DAC3.5(!CS) ; also sheet 10
+5VDD_ISO: C19.1 DAC3.1(VDD) DAC3.10(VLOGIC) ; also sheet 6,10,11
GND: C19.2 C20.2 C21.2 C22.2 DAC3.3(AGND) DAC3.8(!LDAC) DAC3.9(DGND) ; also sheet 1,2,3,4,5,6,7,9,10,11,12
N$58: DAC3.2(VOUT) R41.1
N$59: C21.1 R41.2 R42.1
N$71: C22.1 OP9.3(+IN) R42.2
SCLK_FF: DAC3.6(SCLK) ; also sheet 10
SDI_FF: DAC3.7(DIN) ; also sheet 10
SHNT_FF: OP9.1(OUT) OP9.4(-IN) ; also sheet 6
V_REF2: C20.1 DAC3.4(REF) ; also sheet 9

### Notes on the sheet
- Feedforward DAC
- AD5541A-B
- Anti-aliasing filter, 
  poles at 161 Hz and 4.1 kHz
  Note: AD5541A adds 6.25 kOhm

## Sheet 9 of 12
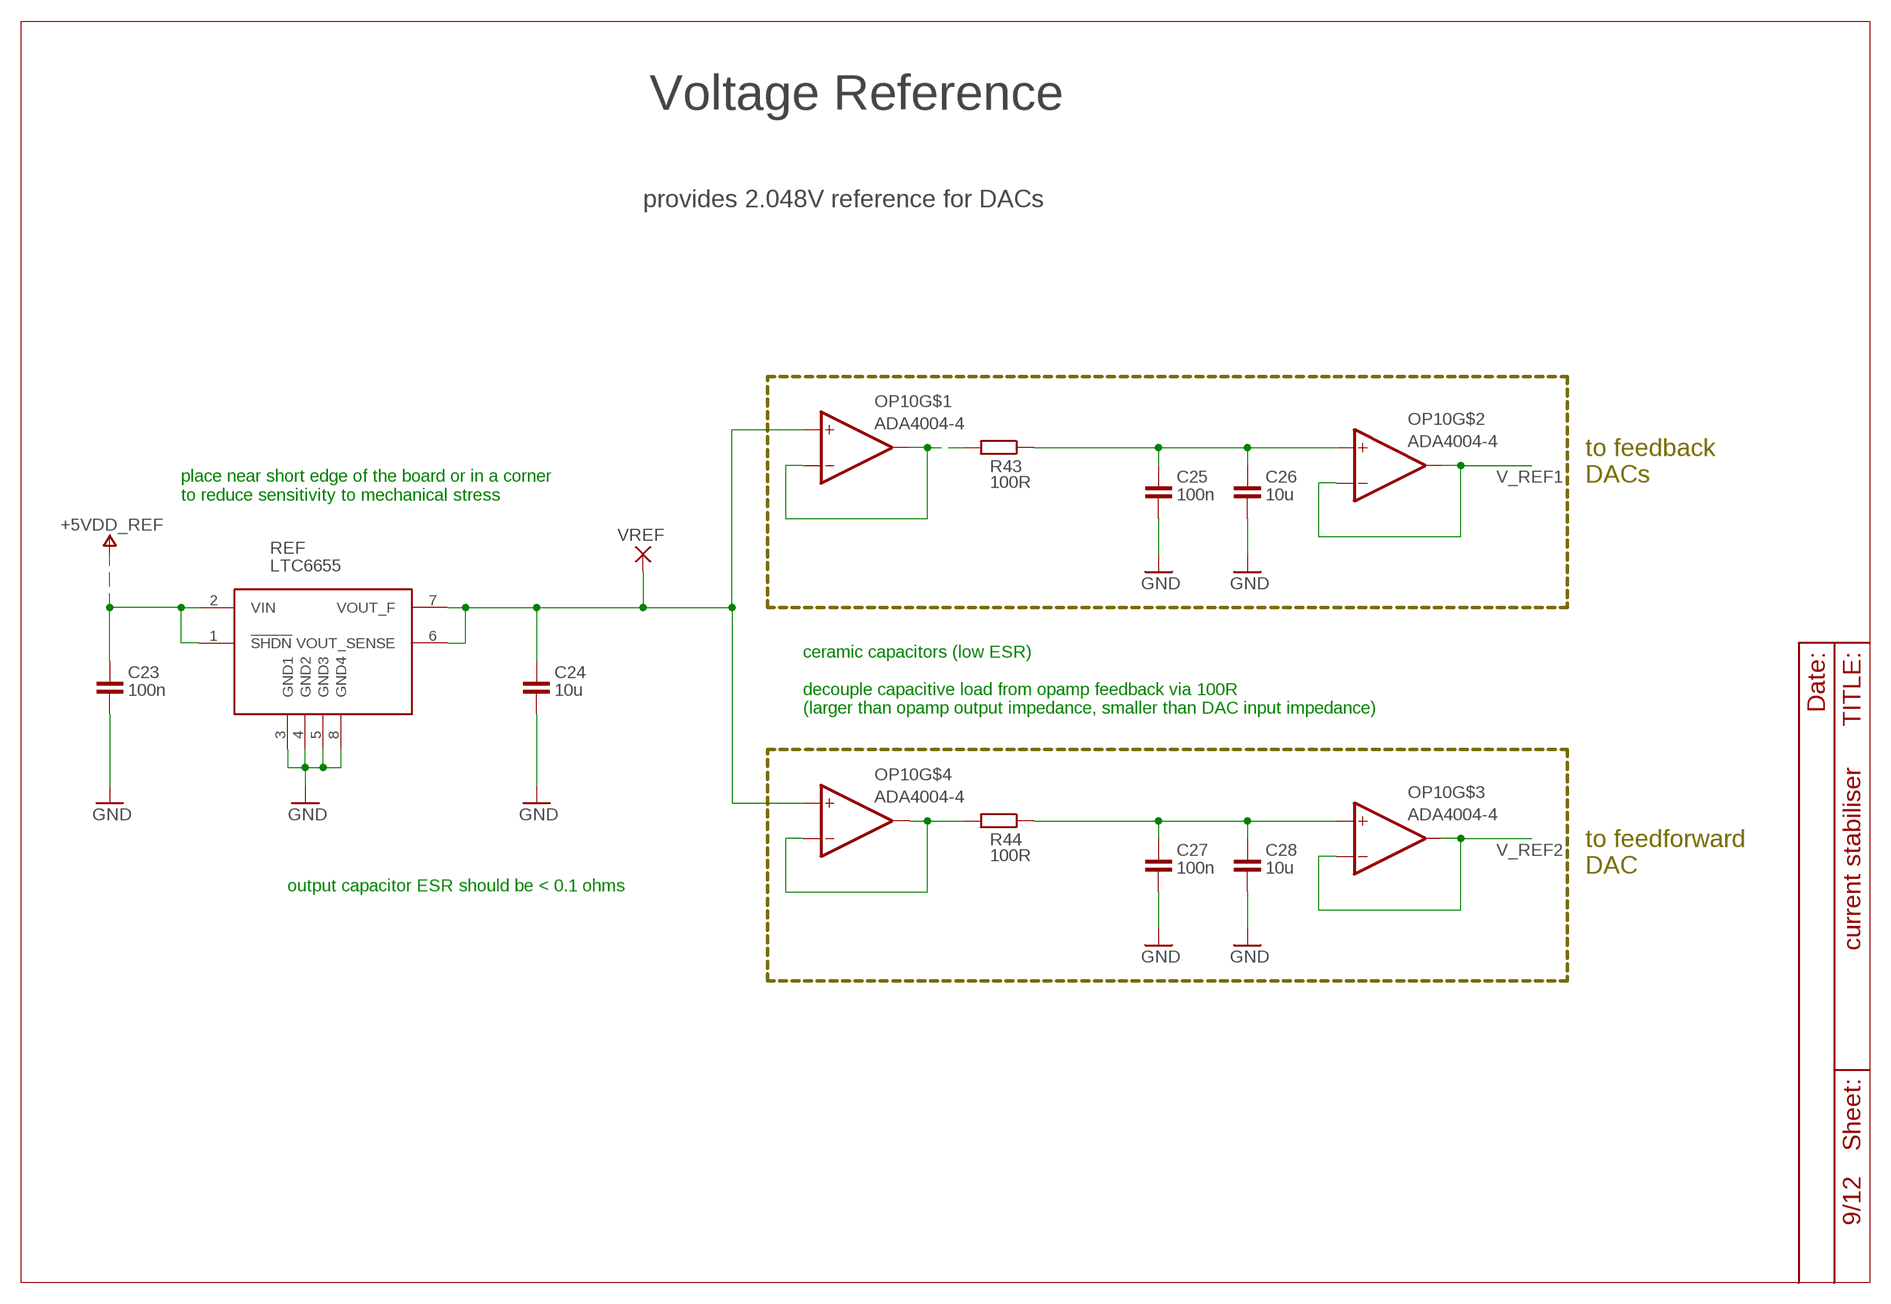
[diagram p8: schematic, sheet 9]

### Parts
C23  100n  CAP0603  [0603]
C24  10u  CAP0805  [0805]
C25  100n  CAP0603  [0603]
C26  10u  CAP0805  [0805]
C27  100n  CAP0603  [0603]
C28  10u  CAP0805  [0805]
OP10  ADA4004-4  OPAMP_QUADSO14  [SO14]
R43  100R  RES0603  [0603]
R44  100R  RES0603  [0603]
REF  LTC6655  [MSOP8]
VREF  TESTPOINT  [TESTPOINT]

### Nets
+5VDD_REF: C23.1 REF.1(!SHDN) REF.2(VIN) ; also sheet 7,11
GND: C23.2 C24.2 C25.2 C26.2 C27.2 C28.2 REF.3(GND1) REF.4(GND2) REF.5(GND3) REF.8(GND4) ; also sheet 1,2,3,4,5,6,7,8,10,11,12
REF: C24.1 OP10.P$3(+IN) OP10.P$12(+IN) REF.6(VOUT_SENSE) REF.7(VOUT_F) VREF.P$1(P)
V_REF1: OP10.P$6(-IN) OP10.P$7(OUT) ; also sheet 7
V_REF1_LP: C25.1 C26.1 OP10.P$5(+IN) R43.1
V_REF1A: OP10.P$1(OUT) OP10.P$2(-IN) R43.2
V_REF2: OP10.P$8(OUT) OP10.P$9(-IN) ; also sheet 8
V_REF2_LP: C27.1 C28.1 OP10.P$10(+IN) R44.1
V_REFBUF1: OP10.P$13(-IN) OP10.P$14(OUT) R44.2

### Notes on the sheet
- Voltage Reference
- provides 2.048V reference for DACs
- to feedback
  DACs
- place near short edge of the board or in a corner
  to reduce sensitivity to mechanical stress
- ceramic capacitors (low ESR)
  
  decouple capacitive load from opamp feedback via 100R
  (larger than opamp output impedance, smaller than DAC input impedance)
- to feedforward
  DAC
- output capacitor ESR should be < 0.1 ohms

## Sheet 10 of 12
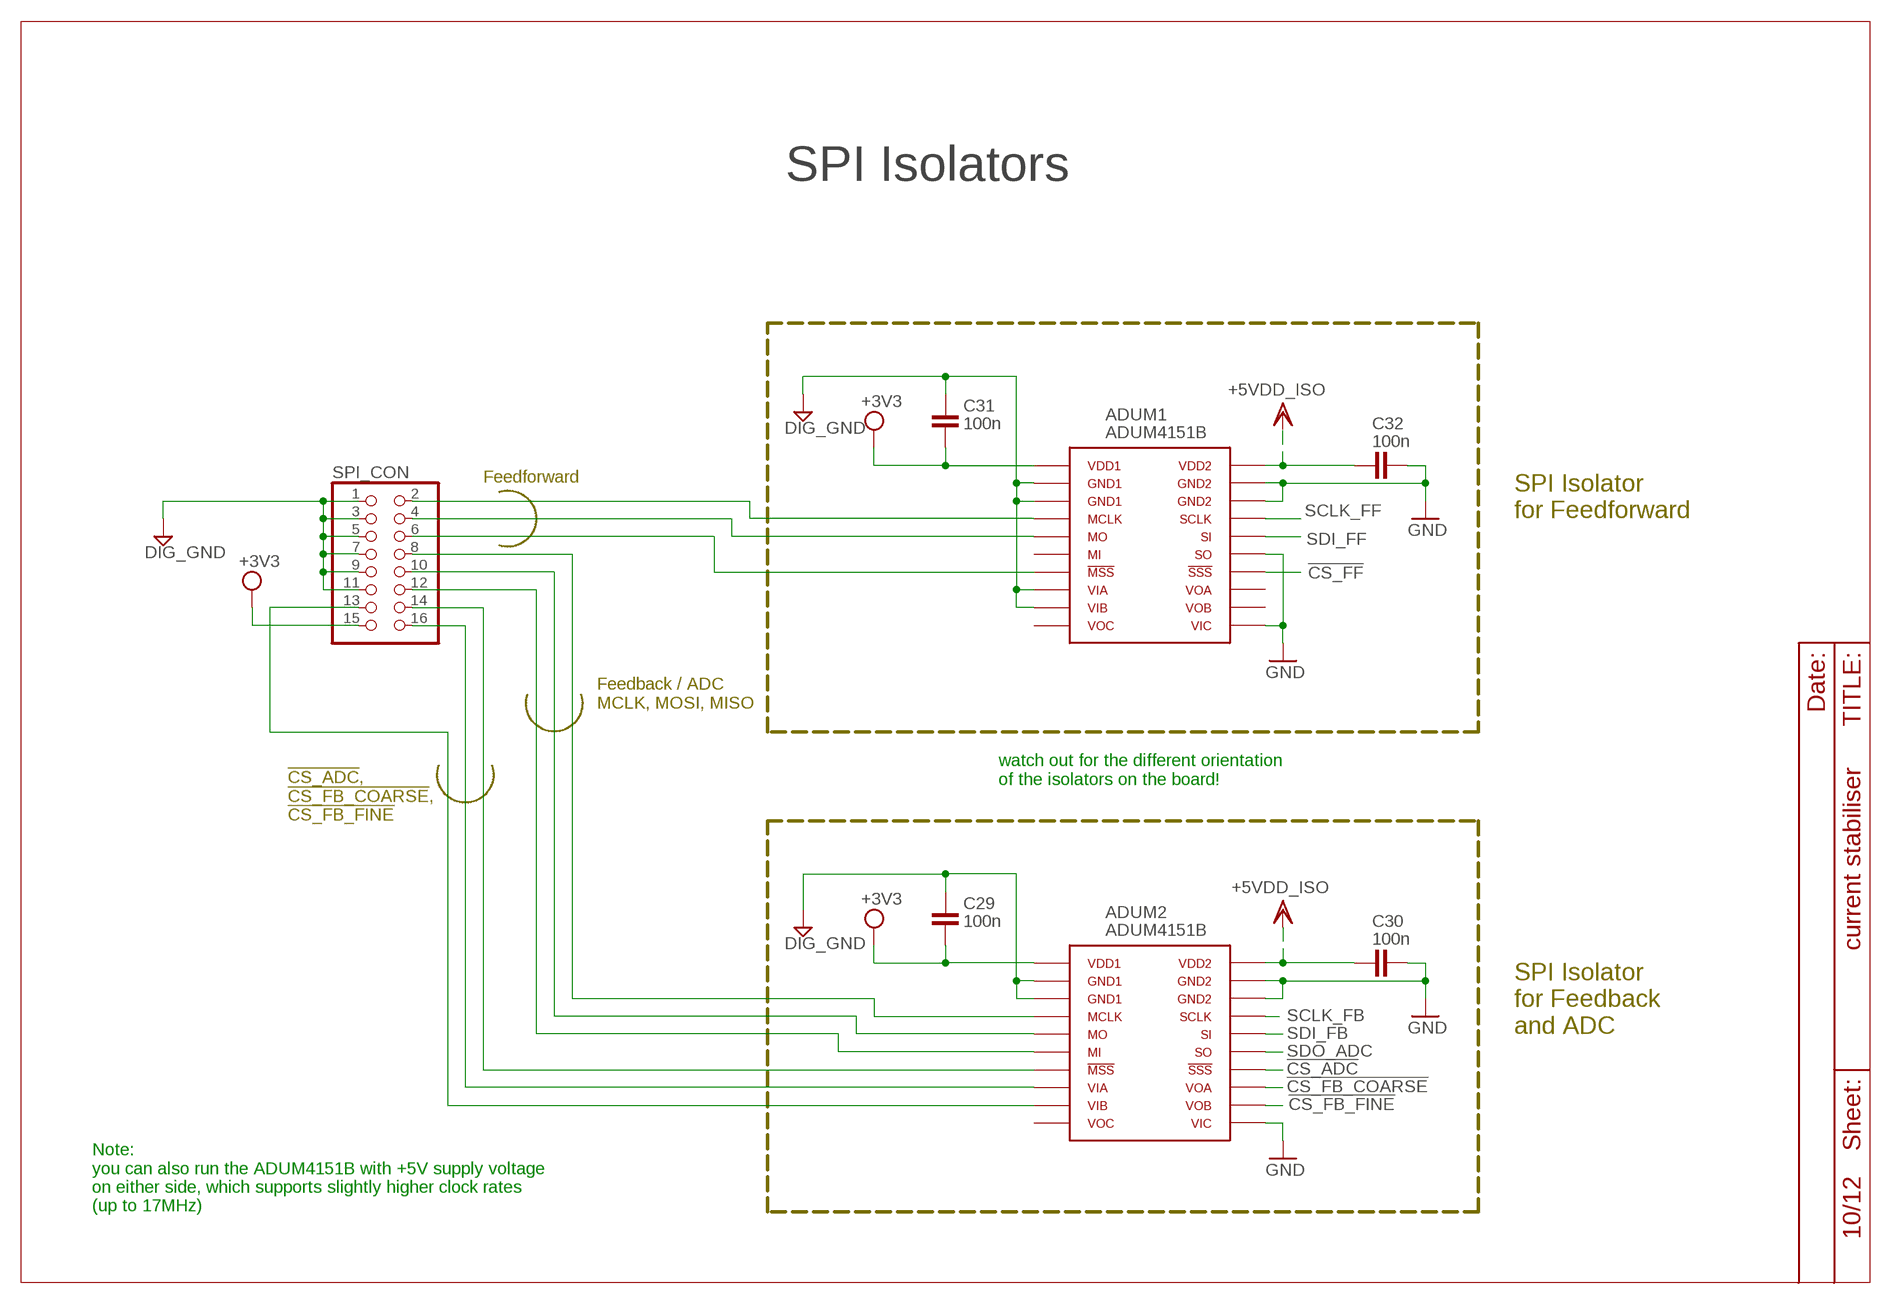
[diagram p9: schematic, sheet 10]

### Parts
ADUM1  ADUM4151B  ADUM4151SOIC_IC-20  [SOIC_IC-20]
ADUM2  ADUM4151B  ADUM4151SOIC_IC-20  [SOIC_IC-20]
C29  100n  CAP0603  [0603]
C30  100n  CAP0603  [0603]
C31  100n  CAP0603  [0603]
C32  100n  CAP0603  [0603]
SPI_CON  SPI_FB  HEADER-2X8  [HEADER-2X8-BOX]

### Nets
!CS_ADC: ADUM2.15(!SSS) ; also sheet 6
!CS_FB_COARSE: ADUM2.14(VOA) ; also sheet 7
!CS_FB_FINE: ADUM2.13(VOB) ; also sheet 7
!CS_FF: ADUM1.15(!SSS) ; also sheet 8
+3V3DIG: ADUM1.1(VDD1) ADUM2.1(VDD1) C29.2 C31.2 SPI_CON.15 ; supply symbol labelled +3V3
+5VDD_ISO: ADUM1.20(VDD2) ADUM2.20(VDD2) C30.1 C32.1 ; also sheet 6,8,11
DGND: ADUM1.2(GND1) ADUM1.7(VIA) ADUM1.8(VIB) ADUM1.10(GND1) ADUM2.2(GND1) ADUM2.10(GND1) C29.1 C31.1 SPI_CON.1 SPI_CON.3 SPI_CON.5 SPI_CON.7 SPI_CON.9 SPI_CON.11 ; supply symbol labelled DIG_GND
DIG_FF_CLK: ADUM1.3(MCLK) SPI_CON.2
DIG_FF_CS: ADUM1.6(!MSS) SPI_CON.6
DIG_FF_SIG: ADUM1.4(MO) SPI_CON.4
GND: ADUM1.11(GND2) ADUM1.12(VIC) ADUM1.16(SO) ADUM1.19(GND2) ADUM2.11(GND2) ADUM2.12(VIC) ADUM2.19(GND2) C30.2 C32.2 ; also sheet 1,2,3,4,5,6,7,8,9,11,12
N$53: ADUM2.4(MO) SPI_CON.10
N$54: ADUM2.5(MI) SPI_CON.12
N$55: ADUM2.6(!MSS) SPI_CON.14
N$56: ADUM2.7(VIA) SPI_CON.16
N$57: ADUM2.8(VIB) SPI_CON.13
N$63: ADUM2.3(MCLK) SPI_CON.8
SCLK_FB: ADUM2.18(SCLK) ; also sheet 6,7
SCLK_FF: ADUM1.18(SCLK) ; also sheet 8
SDI_FB: ADUM2.17(SI) ; also sheet 7
SDI_FF: ADUM1.17(SI) ; also sheet 8
SDO_ADC: ADUM2.16(SO) ; also sheet 6
Unconnected: ADUM1.5(MI) ADUM1.9(VOC) ADUM1.13(VOB) ADUM1.14(VOA) ADUM2.9(VOC)

### Notes on the sheet
- SPI Isolators
- Feedforward
- SPI Isolator
  for Feedforward
- Feedback / ADC
  MCLK, MOSI, MISO
- watch out for the different orientation
  of the isolators on the board!
- !CS_ADC,
  !CS_FB_COARSE,
  !CS_FB_FINE
- SPI Isolator
  for Feedback
  and ADC
- Note: 
  you can also run the ADUM4151B with +5V supply voltage 
  on either side, which supports slightly higher clock rates 
  (up to 17MHz)

## Sheet 11 of 12
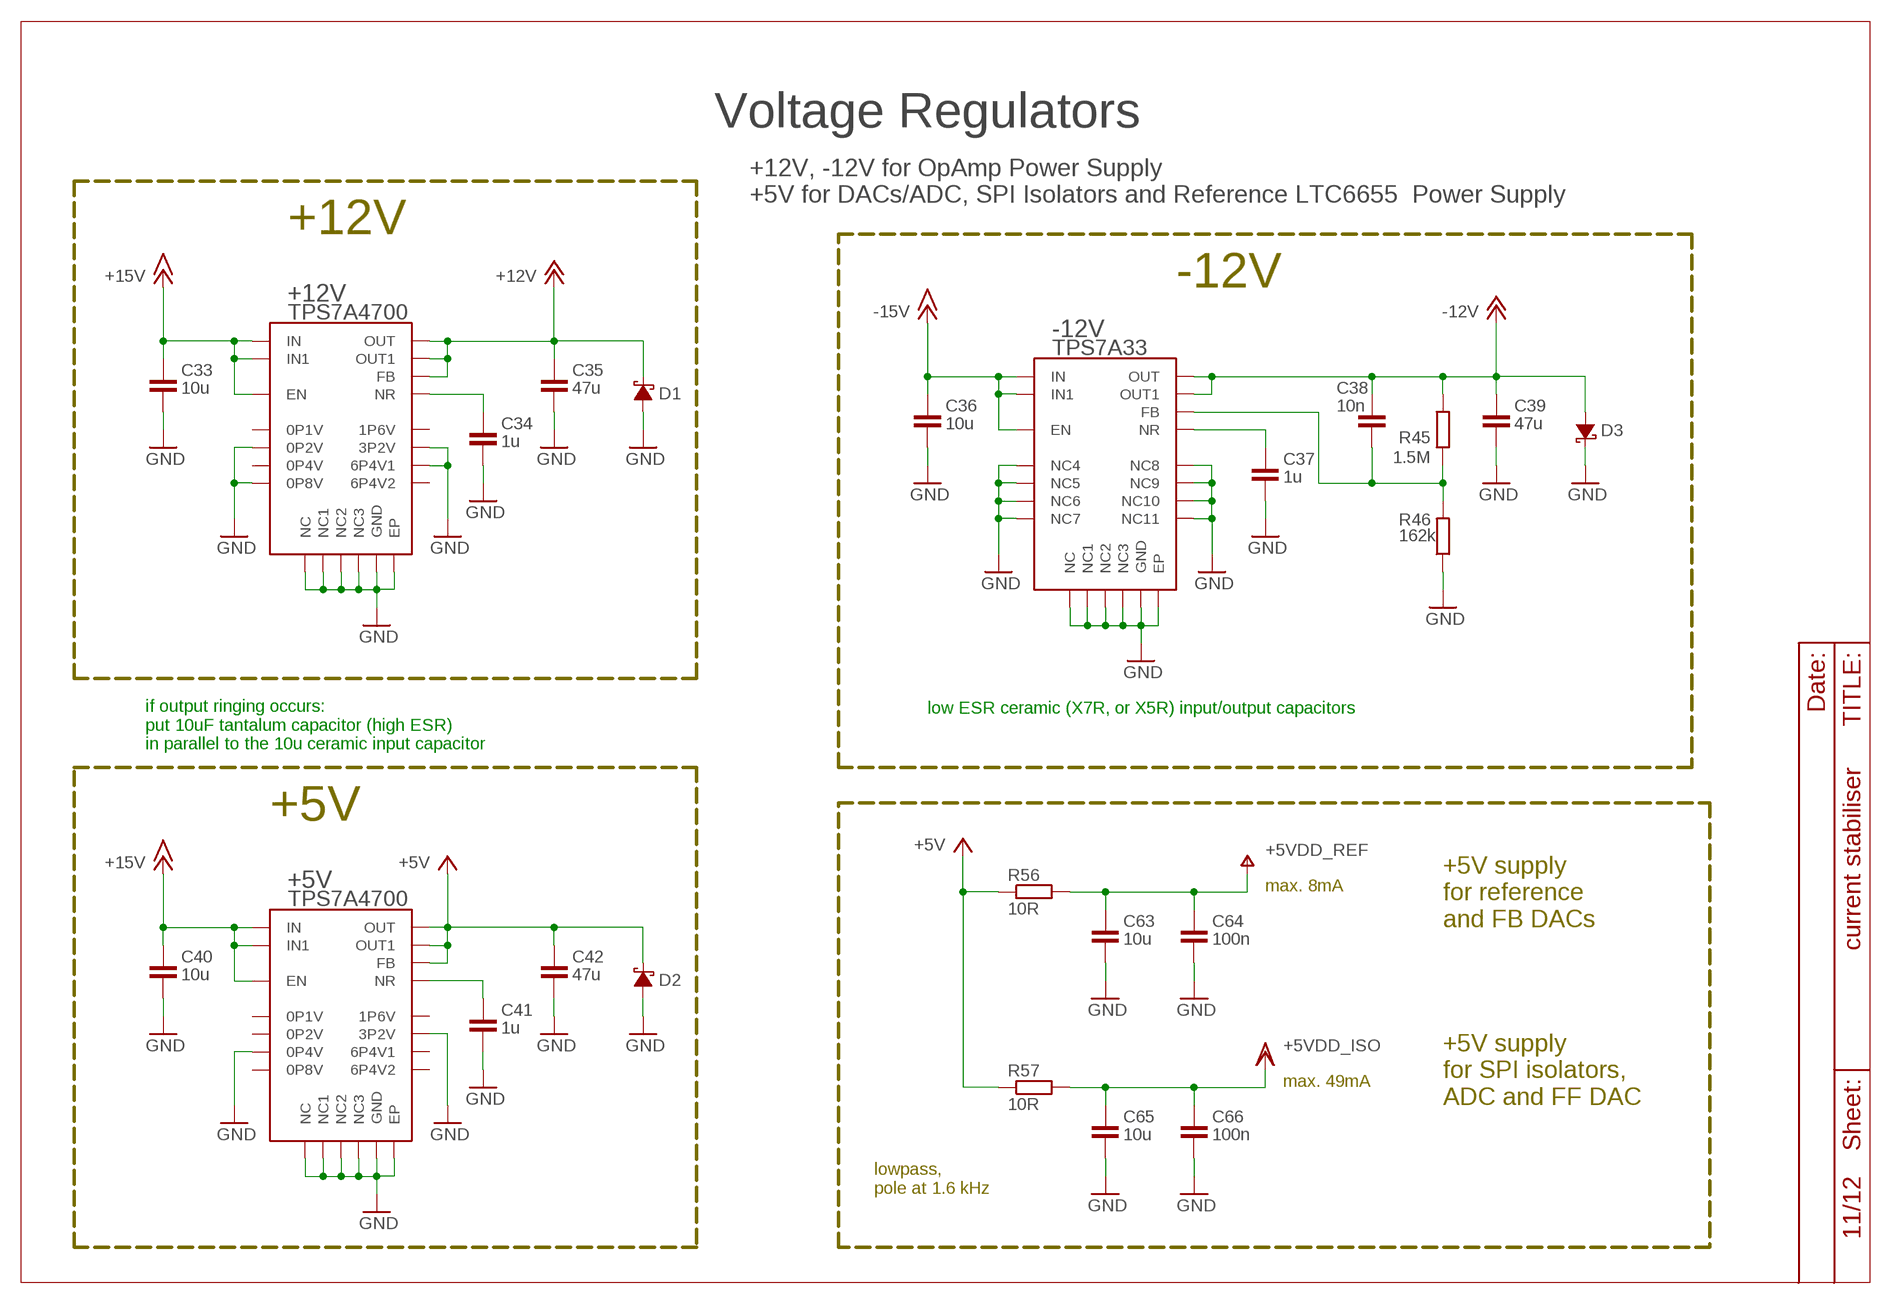
[diagram p10: schematic, sheet 11]

### Parts
+5V  TPS7A4700  TPS7A470X  [QFN20_5]
+12V  TPS7A4700  TPS7A470X  [QFN20_5]
-12V  TPS7A33  [QFN20_5]
C33  10u  CAP0805  [0805]
C34  1u  CAP0805  [0805]
C35  47u  CAP1206  [1206]
C36  10u  CAP0805  [0805]
C37  1u  CAP0805  [0805]
C38  10n  CAP0805  [0805]
C39  47u  CAP1206  [1206]
C40  10u  CAP0805  [0805]
C41  1u  CAP0805  [0805]
C42  47u  CAP1206  [1206]
C63  10u  CAP0805  [0805]
C64  100n  CAP0603  [0603]
C65  10u  CAP0805  [0805]
C66  100n  CAP0603  [0603]
D1  DIODE_SCHOTTKY  [SOD523]
D2  DIODE_SCHOTTKY  [SOD523]
D3  DIODE_SCHOTTKY  [SOD523]
R45  1.5M  RES0603  [0603]
R46  162k  RES0603  [0603]
R56  10R  RES0603  [0603]
R57  10R  RES0603  [0603]

### Nets
+5V: +5V.P$1(OUT) +5V.P$3(FB) +5V.P$20(OUT1) C42.1 D2.K R56.1 R57.1
+5VDD_ISO: C65.1 C66.1 R57.2 ; also sheet 6,8,10
+5VDD_REF: C63.1 C64.1 R56.2 ; also sheet 7,9
+12V: +12V.P$1(OUT) +12V.P$3(FB) +12V.P$20(OUT1) C35.1 D1.K ; also sheet 6,12
+15V: +5V.P$13(EN) +5V.P$15(IN) +5V.P$16(IN1) +12V.P$13(EN) +12V.P$15(IN) +12V.P$16(IN1) C33.1 C40.1 ; also sheet 12
-12V: -12V.P$1(OUT) -12V.P$20(OUT1) C38.1 C39.1 D3.A R45.2 ; also sheet 6,12
-15V: -12V.P$13(EN) -12V.P$15(IN) -12V.P$16(IN1) C36.1 ; also sheet 12
GND: +5V.EP +5V.P$2(NC) +5V.P$6(3P2V) +5V.P$7(GND) +5V.P$10(0P4V) +5V.P$17(NC1) +5V.P$18(NC2) +5V.P$19(NC3) +12V.EP +12V.P$2(NC) +12V.P$4(6P4V1) +12V.P$6(3P2V) +12V.P$7(GND) +12V.P$9(0P8V) +12V.P$11(0P2V) +12V.P$17(NC1) +12V.P$18(NC2) +12V.P$19(NC3) -12V.EP -12V.P$2(NC) -12V.P$4(NC1) -12V.P$5(NC2) -12V.P$6(NC3) -12V.P$7(GND) -12V.P$8(NC4) -12V.P$9(NC5) -12V.P$10(NC6) -12V.P$11(NC7) -12V.P$12(NC8) -12V.P$17(NC9) -12V.P$18(NC10) -12V.P$19(NC11) C33.2 C34.2 C35.2 C36.2 C37.2 C39.2 C40.2 C41.2 C42.2 C63.2 C64.2 C65.2 C66.2 D1.A D2.A D3.K R46.1 ; also sheet 1,2,3,4,5,6,7,8,9,10,12
N$44: +5V.P$14(NR) C41.1
N$45: +12V.P$14(NR) C34.1
N$46: -12V.P$3(FB) C38.2 R45.1 R46.2
N$49: -12V.P$14(NR) C37.1
Unconnected: +5V.P$4(6P4V1) +5V.P$5(6P4V2) +5V.P$8(1P6V) +5V.P$9(0P8V) +5V.P$11(0P2V) +5V.P$12(0P1V) +12V.P$5(6P4V2) +12V.P$8(1P6V) +12V.P$10(0P4V) +12V.P$12(0P1V)

### Notes on the sheet
- Voltage Regulators
- +12V, -12V for OpAmp Power Supply
  +5V for DACs/ADC, SPI Isolators and Reference LTC6655  Power Supply
- +12V
- -12V
- low ESR ceramic (X7R, or X5R) input/output capacitors
- if output ringing occurs:
  put 10uF tantalum capacitor (high ESR) 
  in parallel to the 10u ceramic input capacitor
- +5V
- max. 8mA
- +5V supply 
  for reference
  and FB DACs
- max. 49mA
- +5V supply 
  for SPI isolators,
  ADC and FF DAC
- lowpass, 
  pole at 1.6 kHz

## Sheet 12 of 12
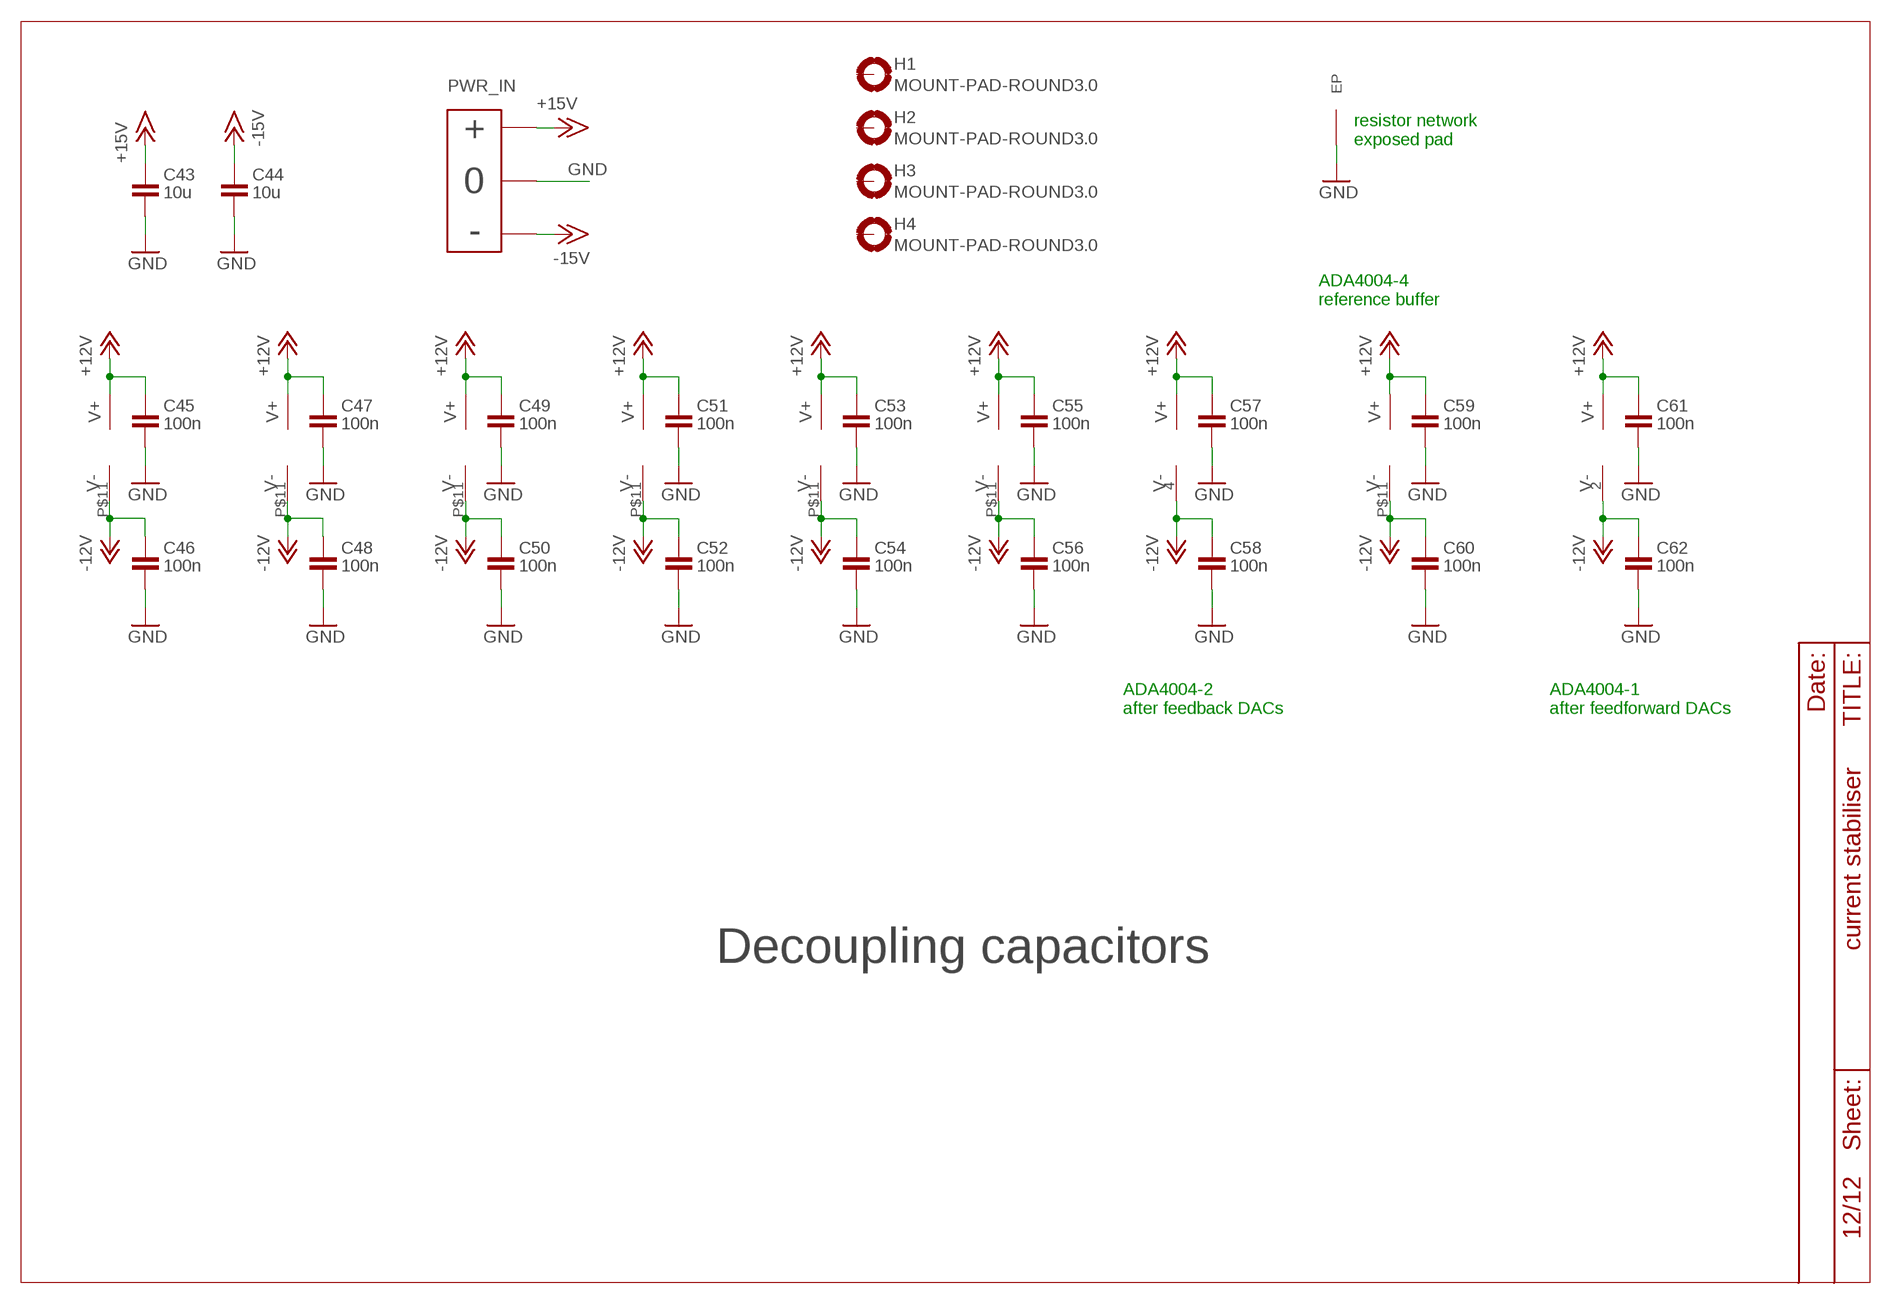
[diagram p11: schematic, sheet 12]

### Parts
C43  10u  CAP0805  [0805]
C44  10u  CAP0805  [0805]
C45  100n  CAP0603  [0603]
C46  100n  CAP0603  [0603]
C47  100n  CAP0603  [0603]
C48  100n  CAP0603  [0603]
C49  100n  CAP0603  [0603]
C50  100n  CAP0603  [0603]
C51  100n  CAP0603  [0603]
C52  100n  CAP0603  [0603]
C53  100n  CAP0603  [0603]
C54  100n  CAP0603  [0603]
C55  100n  CAP0603  [0603]
C56  100n  CAP0603  [0603]
C57  100n  CAP0603  [0603]
C58  100n  CAP0603  [0603]
C59  100n  CAP0603  [0603]
C60  100n  CAP0603  [0603]
C61  100n  CAP0603  [0603]
C62  100n  CAP0603  [0603]
H1  MOUNT-PAD-ROUND3.0  [3,0-PAD]
H2  MOUNT-PAD-ROUND3.0  [3,0-PAD]
H3  MOUNT-PAD-ROUND3.0  [3,0-PAD]
H4  MOUNT-PAD-ROUND3.0  [3,0-PAD]
PWR_IN  MOLEX_POWER_3PINKK  [MOLEX-3PIN]

### Nets
+12V: C45.1 C47.1 C49.1 C51.1 C53.1 C55.1 C57.1 C59.1 C61.1 OP1.P$4(V+) OP2.P$4(V+) OP3.P$4(V+) OP4.P$4(V+) OP5.P$4(V+) OP6.P$4(V+) OP7.8(V+) OP9.5(V+) OP10.P$4(V+) ; also sheet 6,11
+15V: C43.1 PWR_IN.3(+) ; also sheet 11
-12V: C46.1 C48.1 C50.1 C52.1 C54.1 C56.1 C58.1 C60.1 C62.1 OP1.P$11(V-) OP2.P$11(V-) OP3.P$11(V-) OP4.P$11(V-) OP5.P$11(V-) OP6.P$11(V-) OP7.4(V-) OP9.2(V-) OP10.P$11(V-) ; also sheet 6,11
-15V: C44.1 PWR_IN.1(-) ; also sheet 11
GND: C43.2 C44.2 C45.2 C46.2 C47.2 C48.2 C49.2 C50.2 C51.2 C52.2 C53.2 C54.2 C55.2 C56.2 C57.2 C58.2 C59.2 C60.2 C61.2 C62.2 PWR_IN.2 RN.EP(EP:EP) ; also sheet 1,2,3,4,5,6,7,8,9,10,11
Unconnected: H1.B3,0(MOUNT) H2.B3,0(MOUNT) H3.B3,0(MOUNT) H4.B3,0(MOUNT)

### Notes on the sheet
- resistor network
  exposed pad
- ADA4004-4
  reference buffer
- ADA4004-2
  after feedback DACs
- ADA4004-1
  after feedforward DACs
- Decoupling capacitors

## Library data of the parts
+5V +12V = custom-ic:TPS7A470X
-12V = custom-ic:TPS7A33
ADC = custom-ic:AD7477: Analog Devices AD7477 10-bit 1MSPS ADC.
ADUM1 ADUM2 = custom-ic:ADUM4151: Analog Devices ADUM4151 SPI Digital Isolator.
C1-C66 = custom-passive:CAP: capacitor
COMP_IN COMP_OUT NOTCH1_IN NOTCH1_OUT NOTCH2_IN NOTCH2_OUT = pinhead:PINHD-1X2: PIN HEADER
D1-D3 = custom-passive:DIODE_SCHOTTKY: Schottky diodes.
DAC1-DAC3 = custom-ic:AD5541A: 16-bit DAC (Farnell part number 1843653).
DIFF GND VREF = custom-con:TESTPOINT: Testpoint terminal
ERROR SENS_SIG = custom-con:MOLEX_SIG_2PIN: 2 pin Molex KK connector for 1 signal puls GND.
H1-H4 = custom:MOUNT-PAD-ROUND: MOUNTING PAD, round
OP1-OP6 OP10 = custom-ic:OPAMP_QUAD: Quad OpAmp
OP7 = custom-ic:OPAMP_DUAL: Dual op amp
OP9 = custom-ic:OPAMP: Suitable for most OpAmps.
PWR_IN = custom-con:MOLEX_POWER_3PIN
R0 = custom-passive:VCS1625Z: 4-terminal Kelvin-connection resistor. 10R VCS1625Z Farnell p/n 1867926.
R1-R57 = custom-passive:RES
REF = custom-ic:LTC6655
RN = custom-passive:LT5400-EP: Array of 1k resistors (Digikey part number LT5400AHMS8E-4#PBF-ND). with exposed pad
SHNT = custom-con:MOLEX-KK-1X5: Molex KK 6373 Series 2.54mm pitch 1x5 pins Farnell Part Number: 1462952
SJ1-SJ4 = jumper:SJ: SMD solder JUMPER
SPI_CON = custom-con:HEADER-2X8